# EAGLE schematic Display_RevA (EAGLE 6.3)
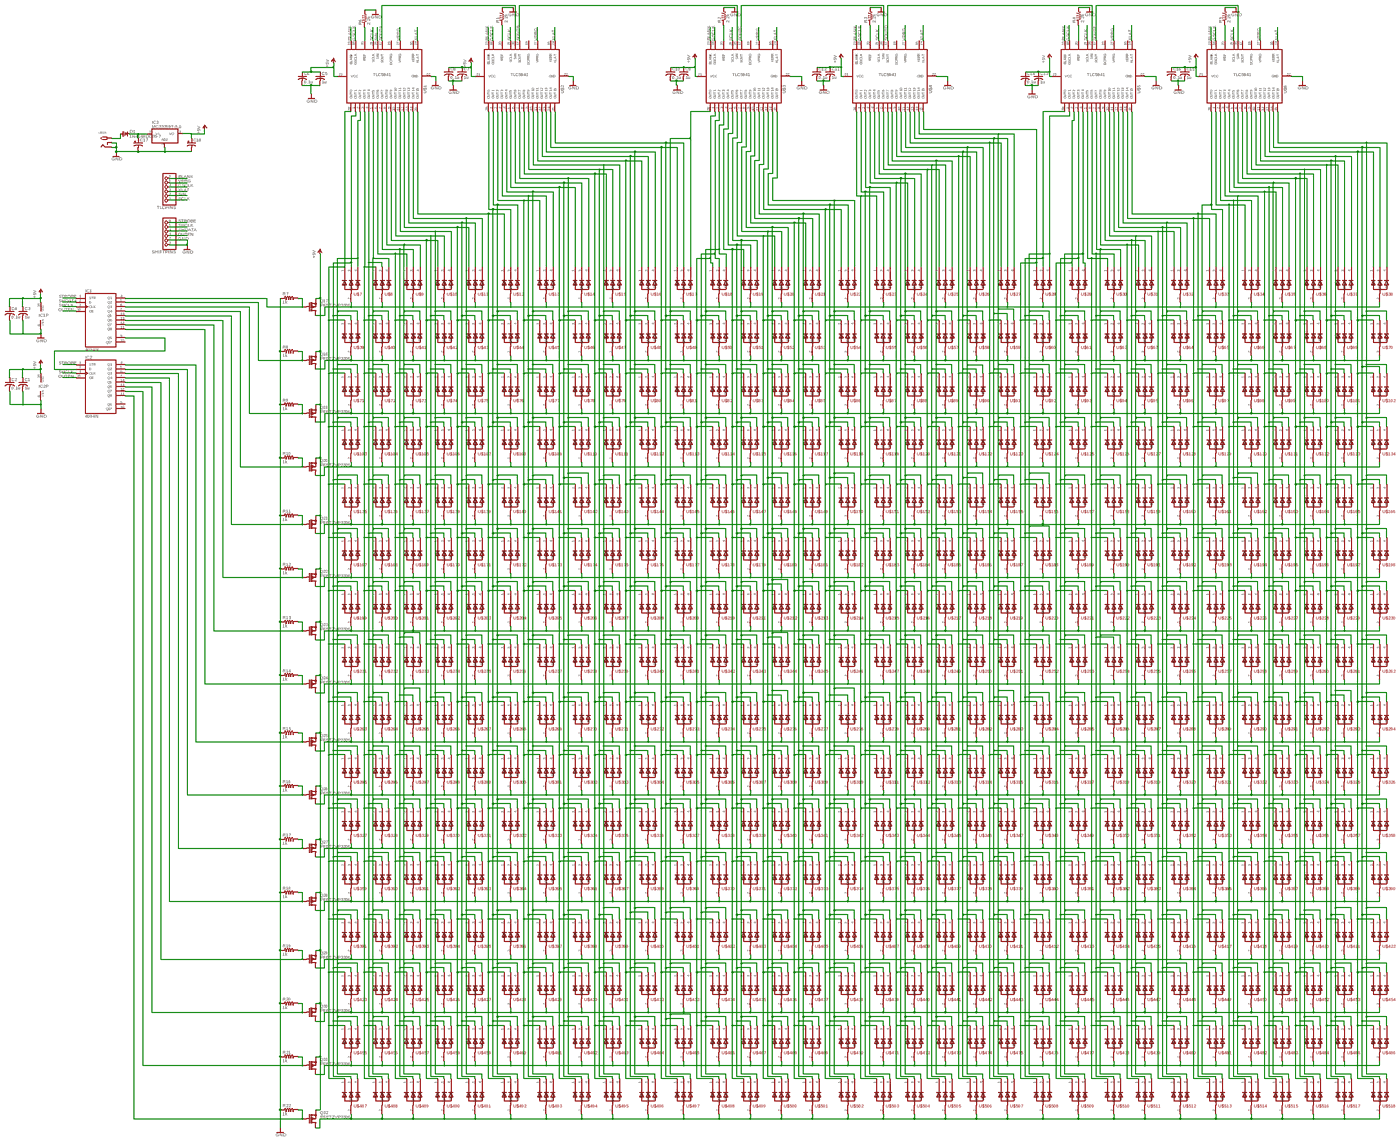
[diagram p0: schematic, sheet 1, overview]
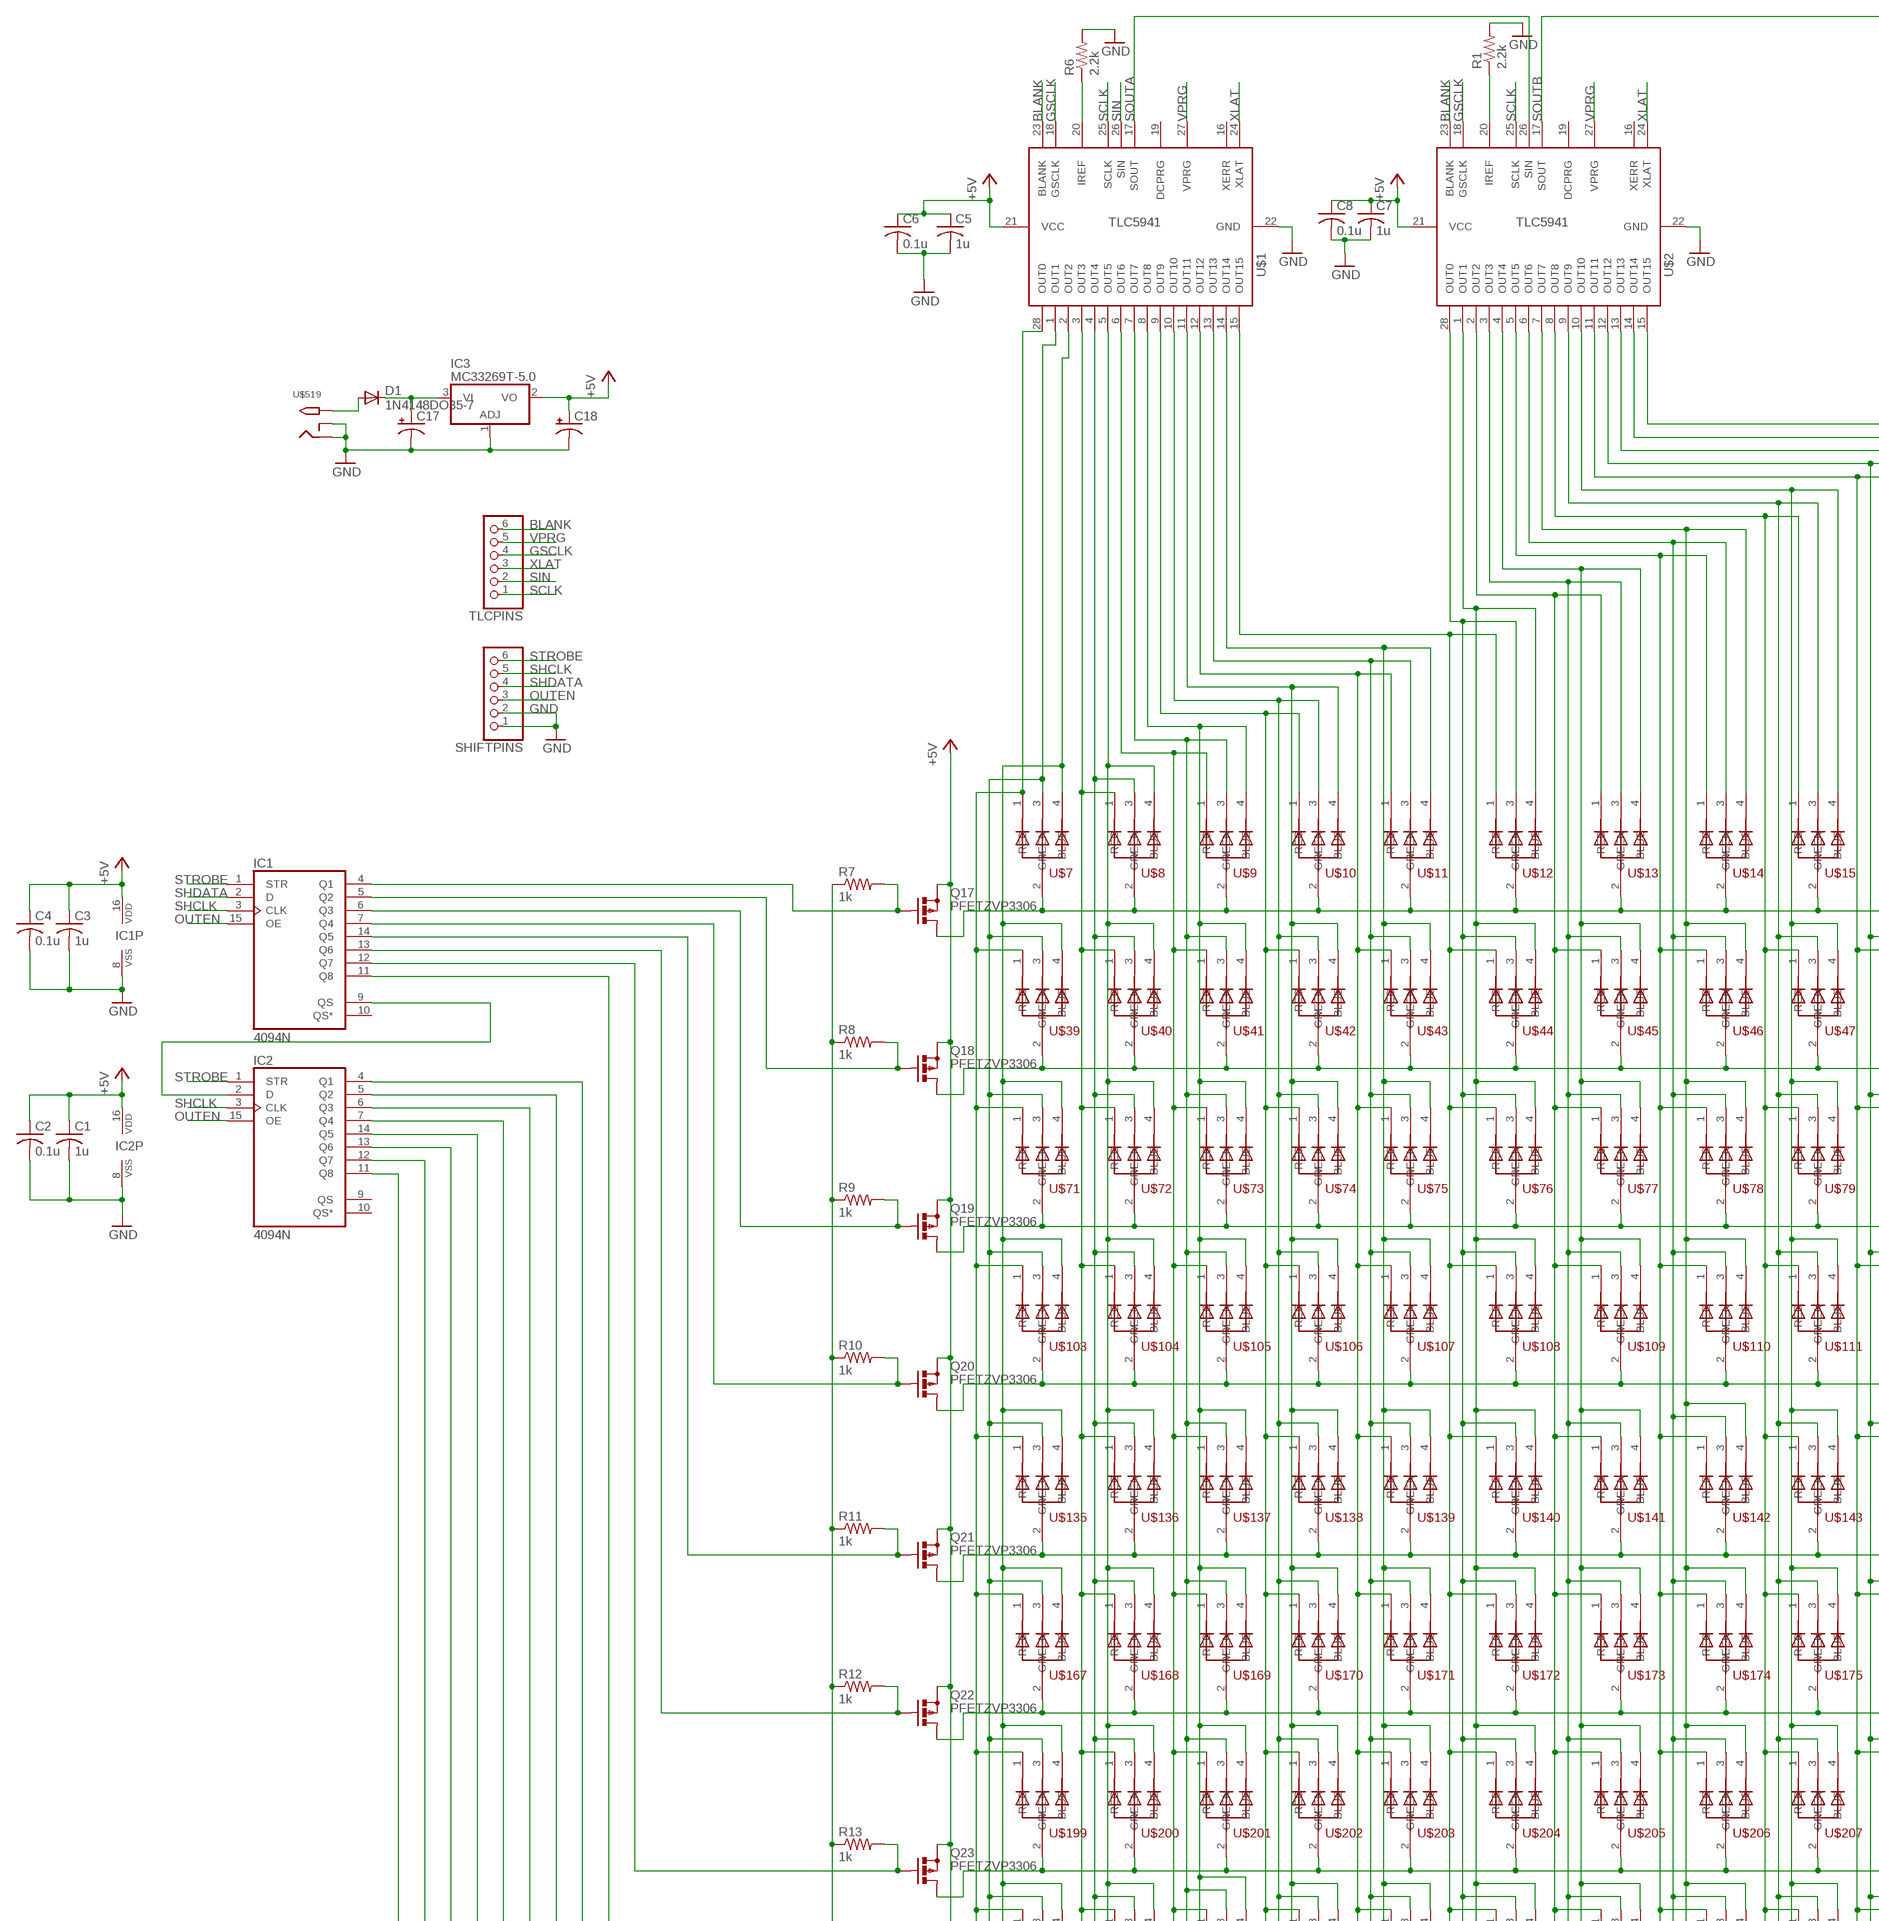
[diagram p1: schematic, sheet 1, part 1 of 4]
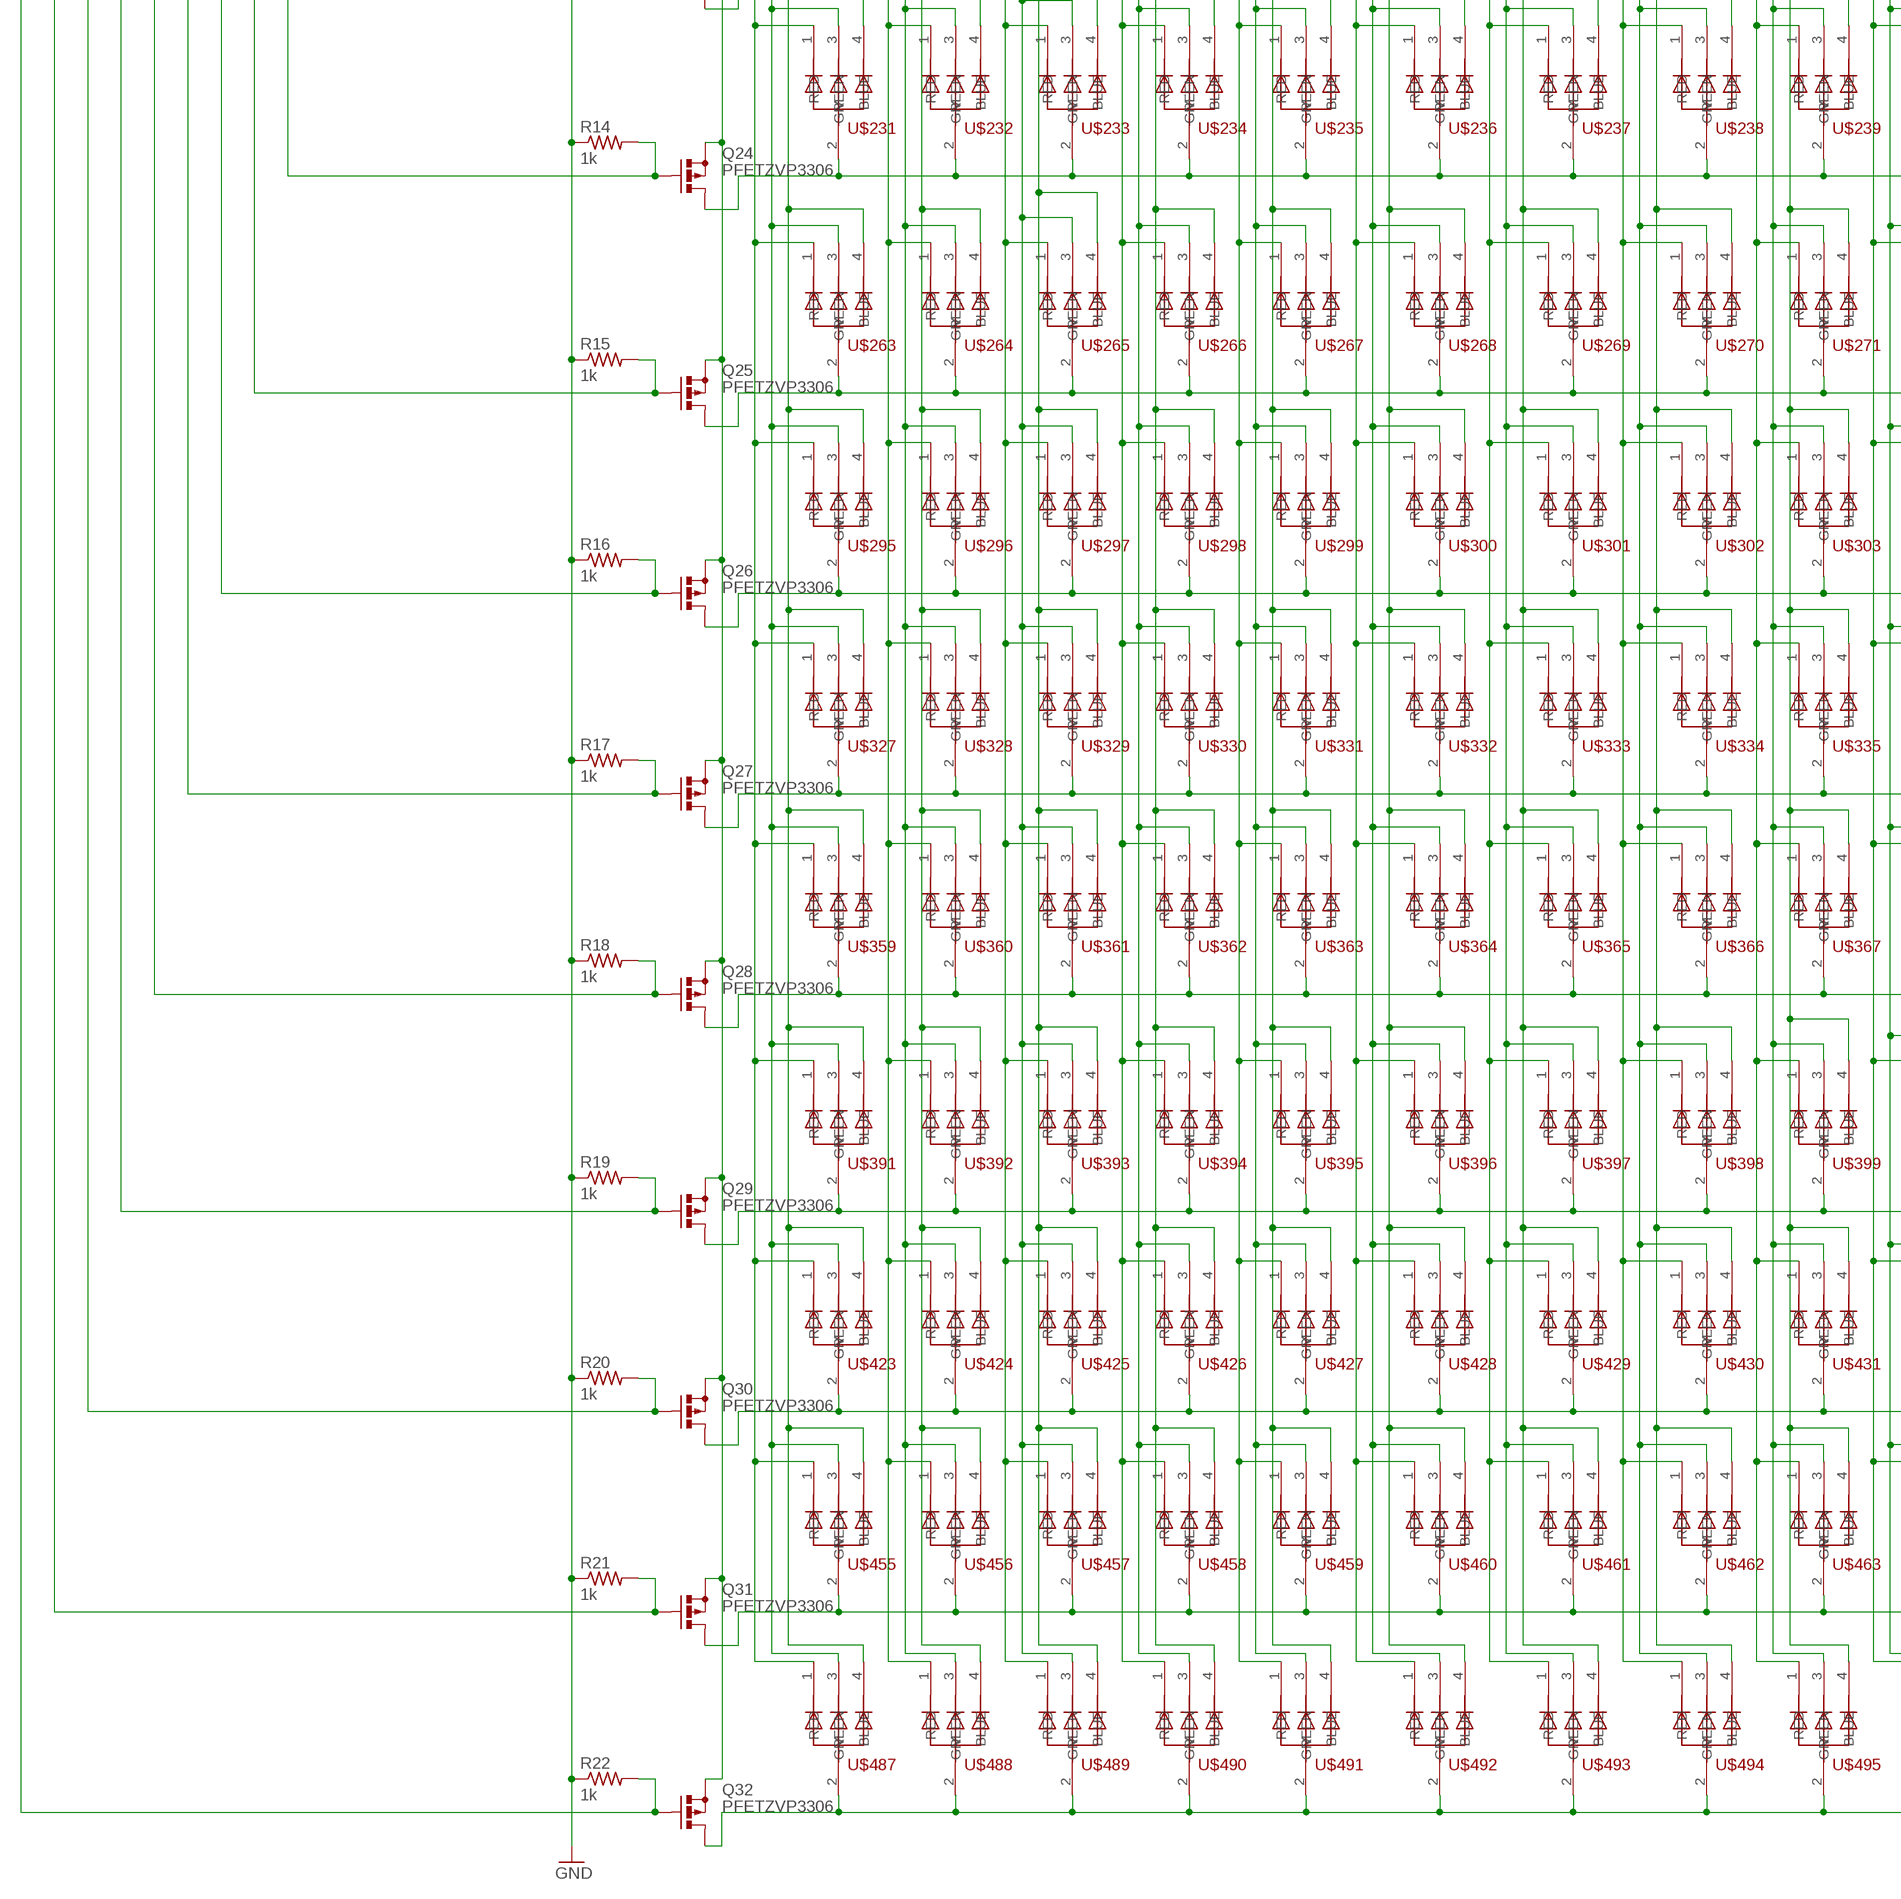
[diagram p2: schematic, sheet 1, part 2 of 4]
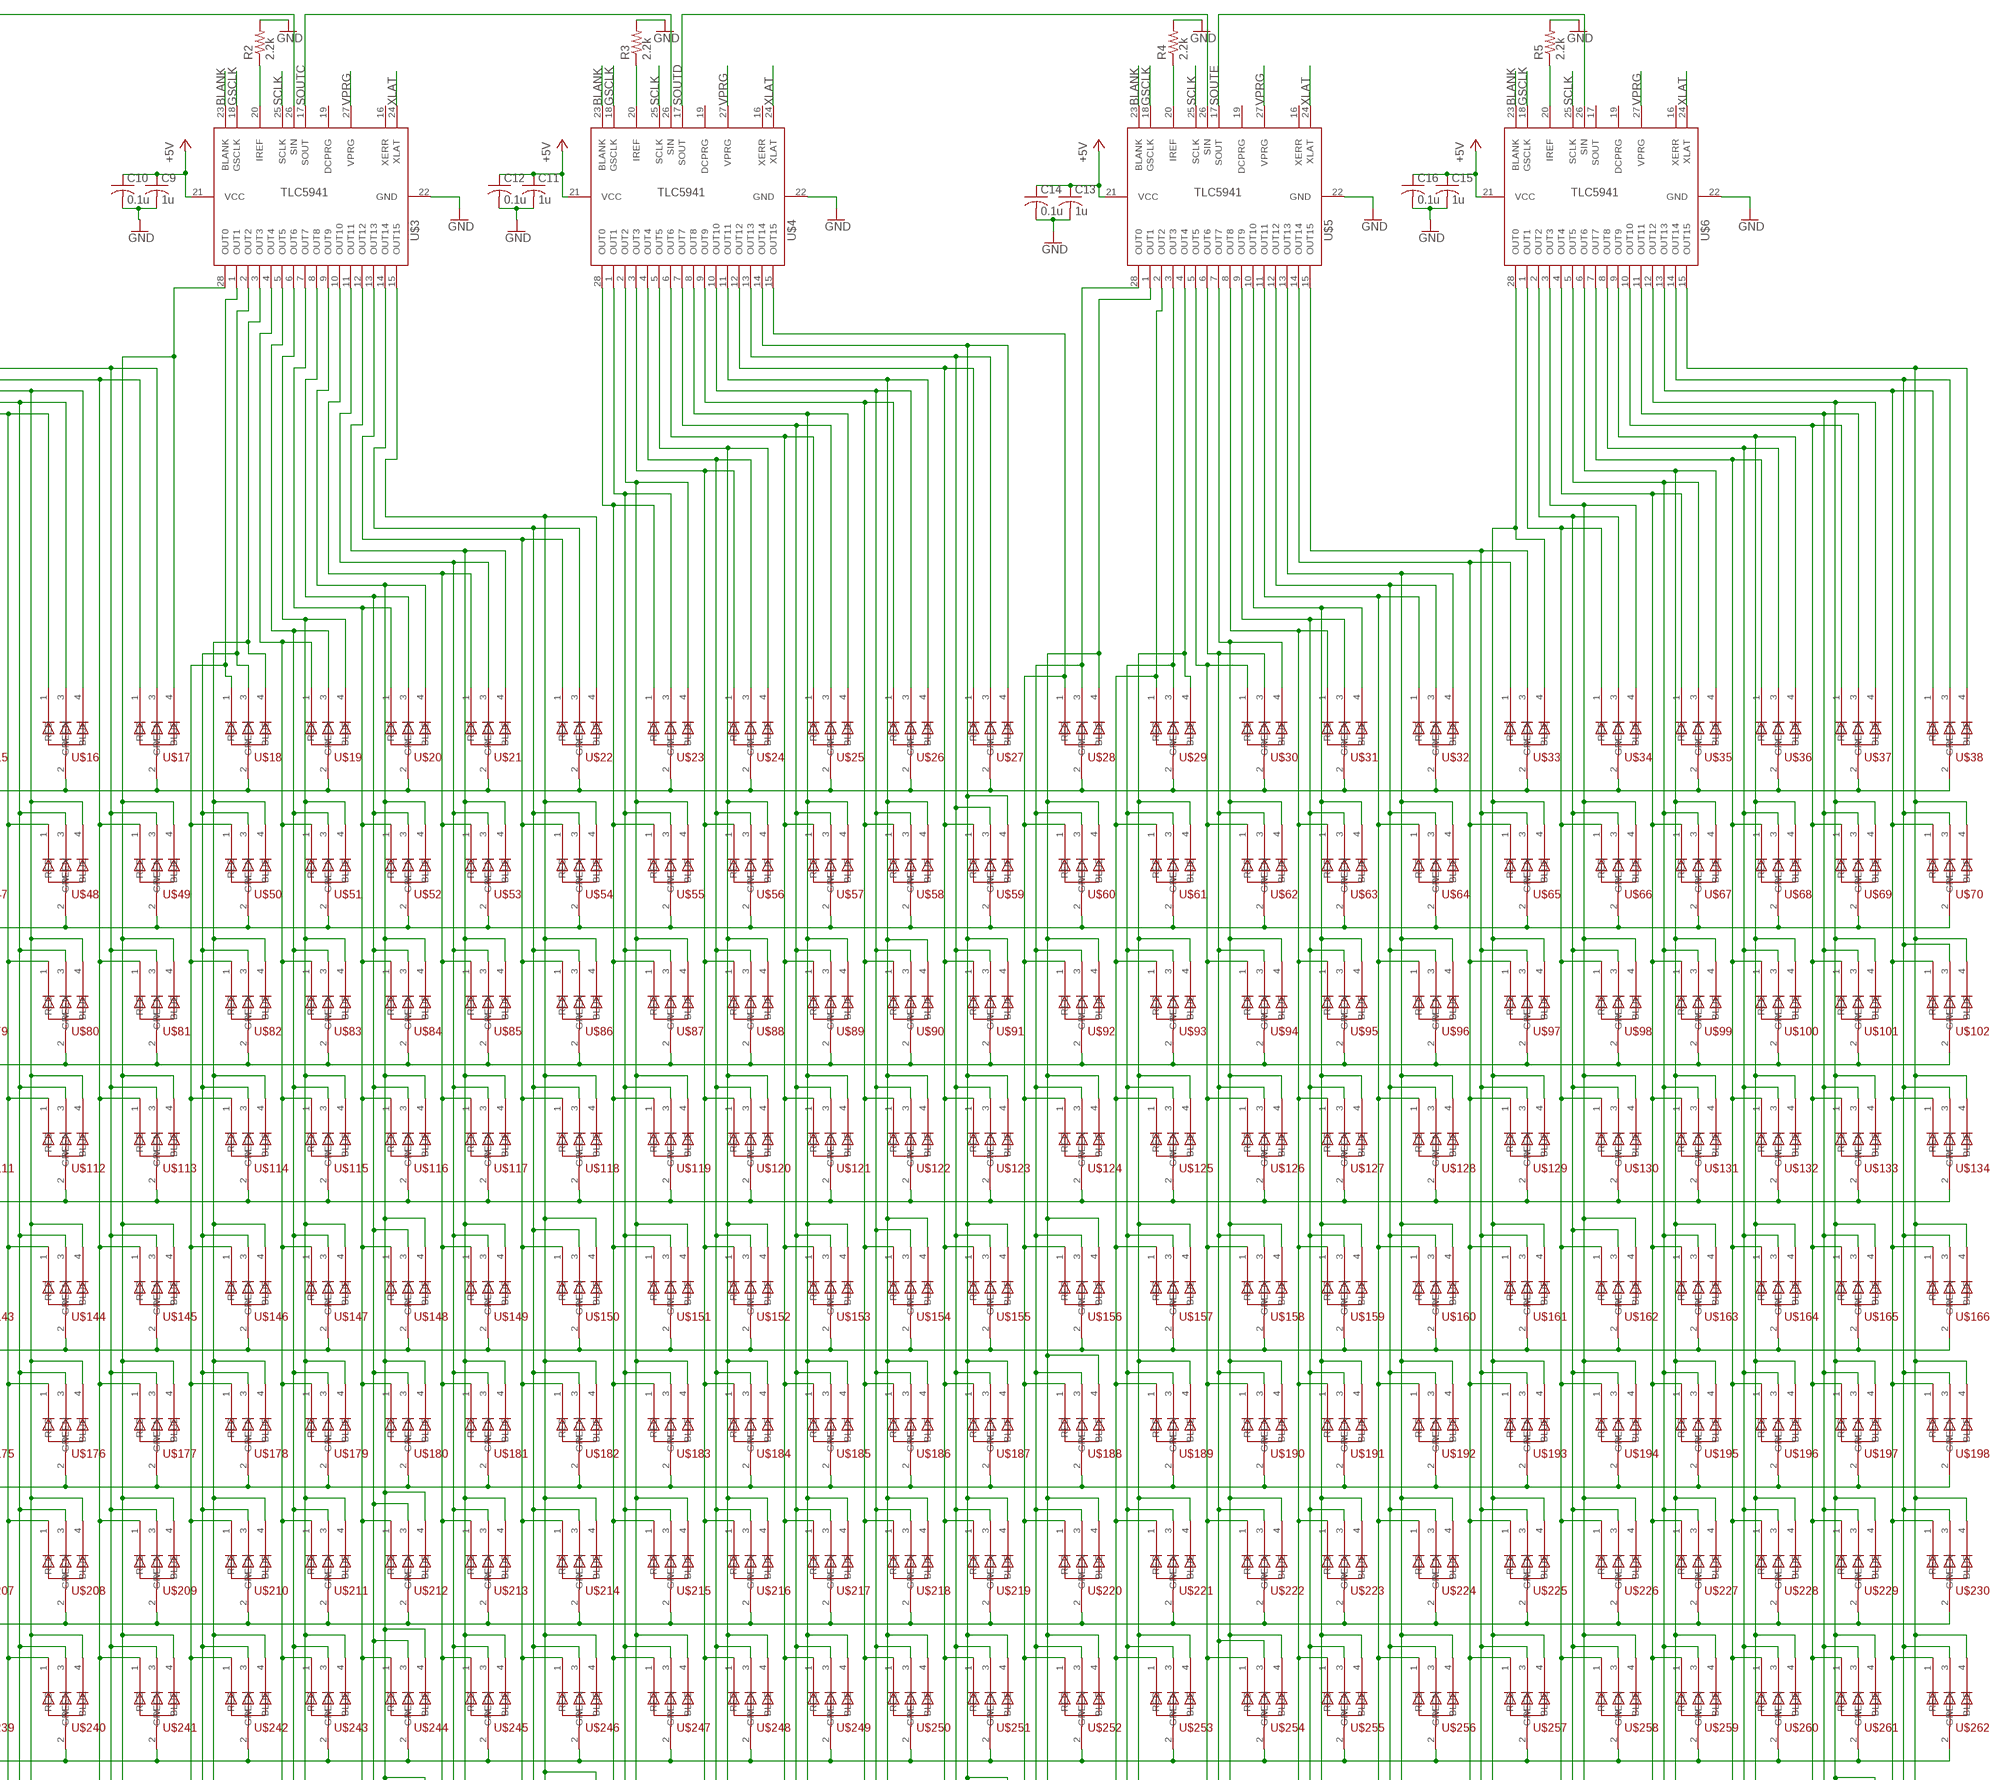
[diagram p3: schematic, sheet 1, part 3 of 4]
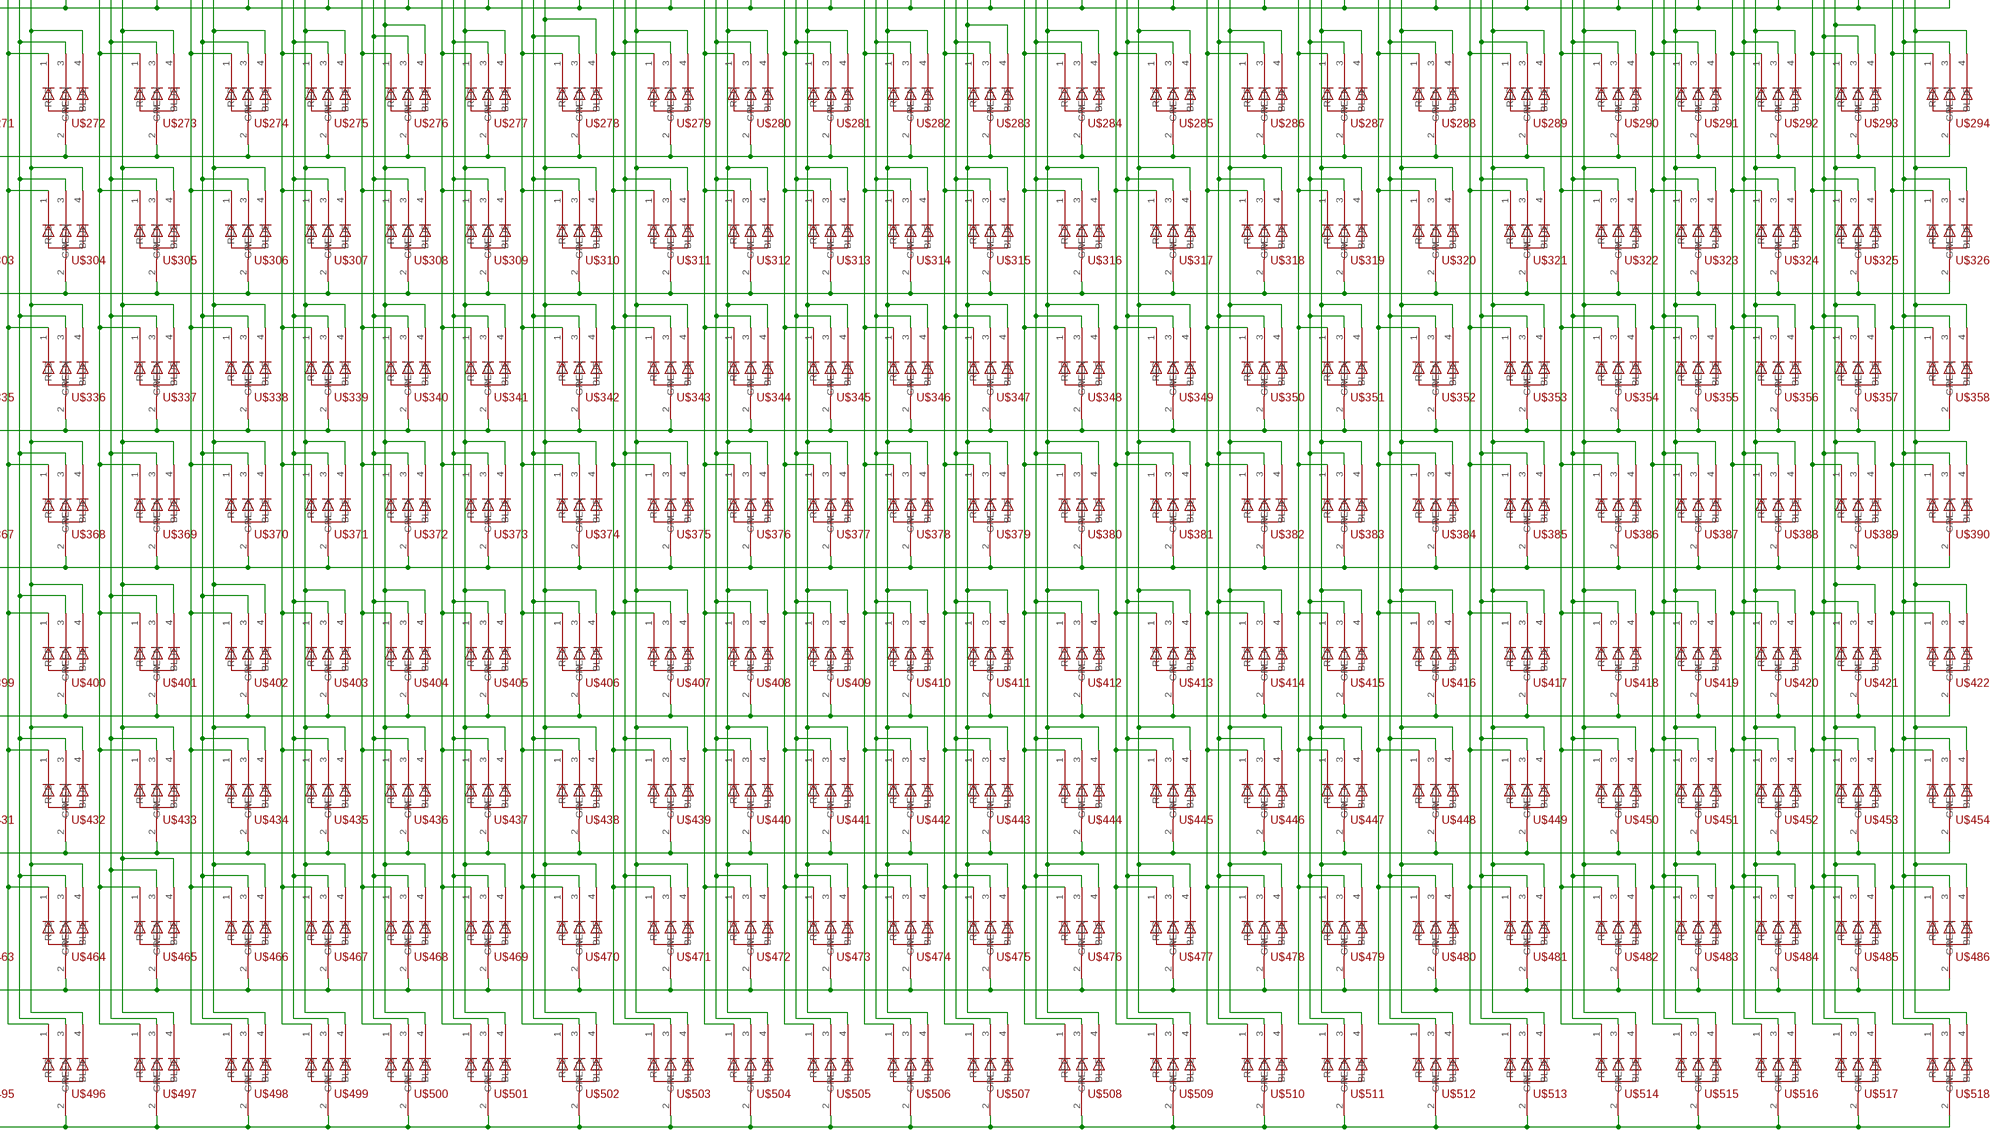
[diagram p4: schematic, sheet 1, part 4 of 4]

## Parts
C1  1u  C-USC0805  [C0805]
C2  0.1u  C-USC0805  [C0805]
C3  1u  C-USC0805  [C0805]
C4  0.1u  C-USC0805  [C0805]
C5  1u  C-USC0805  [C0805]
C6  0.1u  C-USC0805  [C0805]
C7  1u  C-USC0805  [C0805]
C8  0.1u  C-USC0805  [C0805]
C9  1u  C-USC0805  [C0805]
C10  0.1u  C-USC0805  [C0805]
C11  1u  C-USC0805  [C0805]
C12  0.1u  C-USC0805  [C0805]
C13  1u  C-USC0805  [C0805]
C14  0.1u  C-USC0805  [C0805]
C15  1u  C-USC0805  [C0805]
C16  0.1u  C-USC0805  [C0805]
C17  CPOL-USE2.5-5  [E2,5-5]
C18  CPOL-USE2.5-5  [E2,5-5]
D1  1N4148DO35-7  [DO35-7]
IC1  4094N  [DIL16]
IC2  4094N  [DIL16]
IC3  MC33269T-5.0  [TO220V]
Q17  PFETZVP3306  [TO92-OVAL]
Q18  PFETZVP3306  [TO92-OVAL]
Q19  PFETZVP3306  [TO92-OVAL]
Q20  PFETZVP3306  [TO92-OVAL]
Q21  PFETZVP3306  [TO92-OVAL]
Q22  PFETZVP3306  [TO92-OVAL]
Q23  PFETZVP3306  [TO92-OVAL]
Q24  PFETZVP3306  [TO92-OVAL]
Q25  PFETZVP3306  [TO92-OVAL]
Q26  PFETZVP3306  [TO92-OVAL]
Q27  PFETZVP3306  [TO92-OVAL]
Q28  PFETZVP3306  [TO92-OVAL]
Q29  PFETZVP3306  [TO92-OVAL]
Q30  PFETZVP3306  [TO92-OVAL]
Q31  PFETZVP3306  [TO92-OVAL]
Q32  PFETZVP3306  [TO92-OVAL]
R1  2.2k  R-US_R0805  [R0805]
R2  2.2k  R-US_R0805  [R0805]
R3  2.2k  R-US_R0805  [R0805]
R4  2.2k  R-US_R0805  [R0805]
R5  2.2k  R-US_R0805  [R0805]
R6  2.2k  R-US_R0805  [R0805]
R7  1k  R-US_R0805  [R0805]
R8  1k  R-US_R0805  [R0805]
R9  1k  R-US_R0805  [R0805]
R10  1k  R-US_R0805  [R0805]
R11  1k  R-US_R0805  [R0805]
R12  1k  R-US_R0805  [R0805]
R13  1k  R-US_R0805  [R0805]
R14  1k  R-US_R0805  [R0805]
R15  1k  R-US_R0805  [R0805]
R16  1k  R-US_R0805  [R0805]
R17  1k  R-US_R0805  [R0805]
R18  1k  R-US_R0805  [R0805]
R19  1k  R-US_R0805  [R0805]
R20  1k  R-US_R0805  [R0805]
R21  1k  R-US_R0805  [R0805]
R22  1k  R-US_R0805  [R0805]
SHIFTPINS  PINHD-1X6  [1X06]
TLCPINS  PINHD-1X6  [1X06]
U$1  TLC5940  [DIL28-3]
U$2  TLC5940  [DIL28-3]
U$3  TLC5940  [DIL28-3]
U$4  TLC5940  [DIL28-3]
U$5  TLC5940  [DIL28-3]
U$6  TLC5940  [DIL28-3]
U$7  RGBLEDAN  [LED5MMRGB]
U$8  RGBLEDAN  [LED5MMRGB]
U$9  RGBLEDAN  [LED5MMRGB]
U$10  RGBLEDAN  [LED5MMRGB]
U$11  RGBLEDAN  [LED5MMRGB]
U$12  RGBLEDAN  [LED5MMRGB]
U$13  RGBLEDAN  [LED5MMRGB]
U$14  RGBLEDAN  [LED5MMRGB]
U$15  RGBLEDAN  [LED5MMRGB]
U$16  RGBLEDAN  [LED5MMRGB]
U$17  RGBLEDAN  [LED5MMRGB]
U$18  RGBLEDAN  [LED5MMRGB]
U$19  RGBLEDAN  [LED5MMRGB]
U$20  RGBLEDAN  [LED5MMRGB]
U$21  RGBLEDAN  [LED5MMRGB]
U$22  RGBLEDAN  [LED5MMRGB]
U$23  RGBLEDAN  [LED5MMRGB]
U$24  RGBLEDAN  [LED5MMRGB]
U$25  RGBLEDAN  [LED5MMRGB]
U$26  RGBLEDAN  [LED5MMRGB]
U$27  RGBLEDAN  [LED5MMRGB]
U$28  RGBLEDAN  [LED5MMRGB]
U$29  RGBLEDAN  [LED5MMRGB]
U$30  RGBLEDAN  [LED5MMRGB]
U$31  RGBLEDAN  [LED5MMRGB]
U$32  RGBLEDAN  [LED5MMRGB]
U$33  RGBLEDAN  [LED5MMRGB]
U$34  RGBLEDAN  [LED5MMRGB]
U$35  RGBLEDAN  [LED5MMRGB]
U$36  RGBLEDAN  [LED5MMRGB]
U$37  RGBLEDAN  [LED5MMRGB]
U$38  RGBLEDAN  [LED5MMRGB]
U$39  RGBLEDAN  [LED5MMRGB]
U$40  RGBLEDAN  [LED5MMRGB]
U$41  RGBLEDAN  [LED5MMRGB]
U$42  RGBLEDAN  [LED5MMRGB]
U$43  RGBLEDAN  [LED5MMRGB]
U$44  RGBLEDAN  [LED5MMRGB]
U$45  RGBLEDAN  [LED5MMRGB]
U$46  RGBLEDAN  [LED5MMRGB]
U$47  RGBLEDAN  [LED5MMRGB]
U$48  RGBLEDAN  [LED5MMRGB]
U$49  RGBLEDAN  [LED5MMRGB]
U$50  RGBLEDAN  [LED5MMRGB]
U$51  RGBLEDAN  [LED5MMRGB]
U$52  RGBLEDAN  [LED5MMRGB]
U$53  RGBLEDAN  [LED5MMRGB]
U$54  RGBLEDAN  [LED5MMRGB]
U$55  RGBLEDAN  [LED5MMRGB]
U$56  RGBLEDAN  [LED5MMRGB]
U$57  RGBLEDAN  [LED5MMRGB]
U$58  RGBLEDAN  [LED5MMRGB]
U$59  RGBLEDAN  [LED5MMRGB]
U$60  RGBLEDAN  [LED5MMRGB]
U$61  RGBLEDAN  [LED5MMRGB]
U$62  RGBLEDAN  [LED5MMRGB]
U$63  RGBLEDAN  [LED5MMRGB]
U$64  RGBLEDAN  [LED5MMRGB]
U$65  RGBLEDAN  [LED5MMRGB]
U$66  RGBLEDAN  [LED5MMRGB]
U$67  RGBLEDAN  [LED5MMRGB]
U$68  RGBLEDAN  [LED5MMRGB]
U$69  RGBLEDAN  [LED5MMRGB]
U$70  RGBLEDAN  [LED5MMRGB]
U$71  RGBLEDAN  [LED5MMRGB]
U$72  RGBLEDAN  [LED5MMRGB]
U$73  RGBLEDAN  [LED5MMRGB]
U$74  RGBLEDAN  [LED5MMRGB]
U$75  RGBLEDAN  [LED5MMRGB]
U$76  RGBLEDAN  [LED5MMRGB]
U$77  RGBLEDAN  [LED5MMRGB]
U$78  RGBLEDAN  [LED5MMRGB]
U$79  RGBLEDAN  [LED5MMRGB]
U$80  RGBLEDAN  [LED5MMRGB]
U$81  RGBLEDAN  [LED5MMRGB]
U$82  RGBLEDAN  [LED5MMRGB]
U$83  RGBLEDAN  [LED5MMRGB]
U$84  RGBLEDAN  [LED5MMRGB]
U$85  RGBLEDAN  [LED5MMRGB]
U$86  RGBLEDAN  [LED5MMRGB]
U$87  RGBLEDAN  [LED5MMRGB]
U$88  RGBLEDAN  [LED5MMRGB]
U$89  RGBLEDAN  [LED5MMRGB]
U$90  RGBLEDAN  [LED5MMRGB]
U$91  RGBLEDAN  [LED5MMRGB]
U$92  RGBLEDAN  [LED5MMRGB]
U$93  RGBLEDAN  [LED5MMRGB]
U$94  RGBLEDAN  [LED5MMRGB]
U$95  RGBLEDAN  [LED5MMRGB]
U$96  RGBLEDAN  [LED5MMRGB]
U$97  RGBLEDAN  [LED5MMRGB]
U$98  RGBLEDAN  [LED5MMRGB]
U$99  RGBLEDAN  [LED5MMRGB]
U$100  RGBLEDAN  [LED5MMRGB]
U$101  RGBLEDAN  [LED5MMRGB]
U$102  RGBLEDAN  [LED5MMRGB]
U$103  RGBLEDAN  [LED5MMRGB]
U$104  RGBLEDAN  [LED5MMRGB]
U$105  RGBLEDAN  [LED5MMRGB]
U$106  RGBLEDAN  [LED5MMRGB]
U$107  RGBLEDAN  [LED5MMRGB]
U$108  RGBLEDAN  [LED5MMRGB]
U$109  RGBLEDAN  [LED5MMRGB]
U$110  RGBLEDAN  [LED5MMRGB]
U$111  RGBLEDAN  [LED5MMRGB]
U$112  RGBLEDAN  [LED5MMRGB]
U$113  RGBLEDAN  [LED5MMRGB]
U$114  RGBLEDAN  [LED5MMRGB]
U$115  RGBLEDAN  [LED5MMRGB]
U$116  RGBLEDAN  [LED5MMRGB]
U$117  RGBLEDAN  [LED5MMRGB]
U$118  RGBLEDAN  [LED5MMRGB]
U$119  RGBLEDAN  [LED5MMRGB]
U$120  RGBLEDAN  [LED5MMRGB]
U$121  RGBLEDAN  [LED5MMRGB]
U$122  RGBLEDAN  [LED5MMRGB]
U$123  RGBLEDAN  [LED5MMRGB]
U$124  RGBLEDAN  [LED5MMRGB]
U$125  RGBLEDAN  [LED5MMRGB]
U$126  RGBLEDAN  [LED5MMRGB]
U$127  RGBLEDAN  [LED5MMRGB]
U$128  RGBLEDAN  [LED5MMRGB]
U$129  RGBLEDAN  [LED5MMRGB]
U$130  RGBLEDAN  [LED5MMRGB]
U$131  RGBLEDAN  [LED5MMRGB]
U$132  RGBLEDAN  [LED5MMRGB]
U$133  RGBLEDAN  [LED5MMRGB]
U$134  RGBLEDAN  [LED5MMRGB]
U$135  RGBLEDAN  [LED5MMRGB]
U$136  RGBLEDAN  [LED5MMRGB]
U$137  RGBLEDAN  [LED5MMRGB]
U$138  RGBLEDAN  [LED5MMRGB]
U$139  RGBLEDAN  [LED5MMRGB]
U$140  RGBLEDAN  [LED5MMRGB]
U$141  RGBLEDAN  [LED5MMRGB]
U$142  RGBLEDAN  [LED5MMRGB]
U$143  RGBLEDAN  [LED5MMRGB]
U$144  RGBLEDAN  [LED5MMRGB]
U$145  RGBLEDAN  [LED5MMRGB]
U$146  RGBLEDAN  [LED5MMRGB]
U$147  RGBLEDAN  [LED5MMRGB]
U$148  RGBLEDAN  [LED5MMRGB]
U$149  RGBLEDAN  [LED5MMRGB]
U$150  RGBLEDAN  [LED5MMRGB]
U$151  RGBLEDAN  [LED5MMRGB]
U$152  RGBLEDAN  [LED5MMRGB]
U$153  RGBLEDAN  [LED5MMRGB]
U$154  RGBLEDAN  [LED5MMRGB]
U$155  RGBLEDAN  [LED5MMRGB]
U$156  RGBLEDAN  [LED5MMRGB]
U$157  RGBLEDAN  [LED5MMRGB]
U$158  RGBLEDAN  [LED5MMRGB]
U$159  RGBLEDAN  [LED5MMRGB]
U$160  RGBLEDAN  [LED5MMRGB]
U$161  RGBLEDAN  [LED5MMRGB]
U$162  RGBLEDAN  [LED5MMRGB]
U$163  RGBLEDAN  [LED5MMRGB]
U$164  RGBLEDAN  [LED5MMRGB]
U$165  RGBLEDAN  [LED5MMRGB]
U$166  RGBLEDAN  [LED5MMRGB]
U$167  RGBLEDAN  [LED5MMRGB]
U$168  RGBLEDAN  [LED5MMRGB]
U$169  RGBLEDAN  [LED5MMRGB]
U$170  RGBLEDAN  [LED5MMRGB]
U$171  RGBLEDAN  [LED5MMRGB]
U$172  RGBLEDAN  [LED5MMRGB]
U$173  RGBLEDAN  [LED5MMRGB]
U$174  RGBLEDAN  [LED5MMRGB]
U$175  RGBLEDAN  [LED5MMRGB]
U$176  RGBLEDAN  [LED5MMRGB]
U$177  RGBLEDAN  [LED5MMRGB]
U$178  RGBLEDAN  [LED5MMRGB]
U$179  RGBLEDAN  [LED5MMRGB]
U$180  RGBLEDAN  [LED5MMRGB]
U$181  RGBLEDAN  [LED5MMRGB]
U$182  RGBLEDAN  [LED5MMRGB]
U$183  RGBLEDAN  [LED5MMRGB]
U$184  RGBLEDAN  [LED5MMRGB]
U$185  RGBLEDAN  [LED5MMRGB]
U$186  RGBLEDAN  [LED5MMRGB]
U$187  RGBLEDAN  [LED5MMRGB]
U$188  RGBLEDAN  [LED5MMRGB]
U$189  RGBLEDAN  [LED5MMRGB]
U$190  RGBLEDAN  [LED5MMRGB]
U$191  RGBLEDAN  [LED5MMRGB]
U$192  RGBLEDAN  [LED5MMRGB]
U$193  RGBLEDAN  [LED5MMRGB]
U$194  RGBLEDAN  [LED5MMRGB]
U$195  RGBLEDAN  [LED5MMRGB]
U$196  RGBLEDAN  [LED5MMRGB]
U$197  RGBLEDAN  [LED5MMRGB]
U$198  RGBLEDAN  [LED5MMRGB]
U$199  RGBLEDAN  [LED5MMRGB]
U$200  RGBLEDAN  [LED5MMRGB]
U$201  RGBLEDAN  [LED5MMRGB]
U$202  RGBLEDAN  [LED5MMRGB]
U$203  RGBLEDAN  [LED5MMRGB]
U$204  RGBLEDAN  [LED5MMRGB]
U$205  RGBLEDAN  [LED5MMRGB]
U$206  RGBLEDAN  [LED5MMRGB]
U$207  RGBLEDAN  [LED5MMRGB]
U$208  RGBLEDAN  [LED5MMRGB]
U$209  RGBLEDAN  [LED5MMRGB]
U$210  RGBLEDAN  [LED5MMRGB]
U$211  RGBLEDAN  [LED5MMRGB]
U$212  RGBLEDAN  [LED5MMRGB]
U$213  RGBLEDAN  [LED5MMRGB]
U$214  RGBLEDAN  [LED5MMRGB]
U$215  RGBLEDAN  [LED5MMRGB]
U$216  RGBLEDAN  [LED5MMRGB]
U$217  RGBLEDAN  [LED5MMRGB]
U$218  RGBLEDAN  [LED5MMRGB]
U$219  RGBLEDAN  [LED5MMRGB]
U$220  RGBLEDAN  [LED5MMRGB]
U$221  RGBLEDAN  [LED5MMRGB]
U$222  RGBLEDAN  [LED5MMRGB]
U$223  RGBLEDAN  [LED5MMRGB]
U$224  RGBLEDAN  [LED5MMRGB]
U$225  RGBLEDAN  [LED5MMRGB]
U$226  RGBLEDAN  [LED5MMRGB]
U$227  RGBLEDAN  [LED5MMRGB]
U$228  RGBLEDAN  [LED5MMRGB]
U$229  RGBLEDAN  [LED5MMRGB]
U$230  RGBLEDAN  [LED5MMRGB]
U$231  RGBLEDAN  [LED5MMRGB]
U$232  RGBLEDAN  [LED5MMRGB]
U$233  RGBLEDAN  [LED5MMRGB]
U$234  RGBLEDAN  [LED5MMRGB]
U$235  RGBLEDAN  [LED5MMRGB]
U$236  RGBLEDAN  [LED5MMRGB]
U$237  RGBLEDAN  [LED5MMRGB]
U$238  RGBLEDAN  [LED5MMRGB]
U$239  RGBLEDAN  [LED5MMRGB]
U$240  RGBLEDAN  [LED5MMRGB]
U$241  RGBLEDAN  [LED5MMRGB]
U$242  RGBLEDAN  [LED5MMRGB]
U$243  RGBLEDAN  [LED5MMRGB]
U$244  RGBLEDAN  [LED5MMRGB]
U$245  RGBLEDAN  [LED5MMRGB]
U$246  RGBLEDAN  [LED5MMRGB]
U$247  RGBLEDAN  [LED5MMRGB]
U$248  RGBLEDAN  [LED5MMRGB]
U$249  RGBLEDAN  [LED5MMRGB]
U$250  RGBLEDAN  [LED5MMRGB]
U$251  RGBLEDAN  [LED5MMRGB]
U$252  RGBLEDAN  [LED5MMRGB]
U$253  RGBLEDAN  [LED5MMRGB]
U$254  RGBLEDAN  [LED5MMRGB]
U$255  RGBLEDAN  [LED5MMRGB]
U$256  RGBLEDAN  [LED5MMRGB]
U$257  RGBLEDAN  [LED5MMRGB]
U$258  RGBLEDAN  [LED5MMRGB]
U$259  RGBLEDAN  [LED5MMRGB]
U$260  RGBLEDAN  [LED5MMRGB]
U$261  RGBLEDAN  [LED5MMRGB]
U$262  RGBLEDAN  [LED5MMRGB]
U$263  RGBLEDAN  [LED5MMRGB]
U$264  RGBLEDAN  [LED5MMRGB]
U$265  RGBLEDAN  [LED5MMRGB]
U$266  RGBLEDAN  [LED5MMRGB]
U$267  RGBLEDAN  [LED5MMRGB]
U$268  RGBLEDAN  [LED5MMRGB]
U$269  RGBLEDAN  [LED5MMRGB]
U$270  RGBLEDAN  [LED5MMRGB]
U$271  RGBLEDAN  [LED5MMRGB]
U$272  RGBLEDAN  [LED5MMRGB]
U$273  RGBLEDAN  [LED5MMRGB]
U$274  RGBLEDAN  [LED5MMRGB]
U$275  RGBLEDAN  [LED5MMRGB]
U$276  RGBLEDAN  [LED5MMRGB]
U$277  RGBLEDAN  [LED5MMRGB]
U$278  RGBLEDAN  [LED5MMRGB]
U$279  RGBLEDAN  [LED5MMRGB]
U$280  RGBLEDAN  [LED5MMRGB]
U$281  RGBLEDAN  [LED5MMRGB]
U$282  RGBLEDAN  [LED5MMRGB]
U$283  RGBLEDAN  [LED5MMRGB]
U$284  RGBLEDAN  [LED5MMRGB]
U$285  RGBLEDAN  [LED5MMRGB]
U$286  RGBLEDAN  [LED5MMRGB]
U$287  RGBLEDAN  [LED5MMRGB]
U$288  RGBLEDAN  [LED5MMRGB]
U$289  RGBLEDAN  [LED5MMRGB]
U$290  RGBLEDAN  [LED5MMRGB]
U$291  RGBLEDAN  [LED5MMRGB]
U$292  RGBLEDAN  [LED5MMRGB]
U$293  RGBLEDAN  [LED5MMRGB]
U$294  RGBLEDAN  [LED5MMRGB]
U$295  RGBLEDAN  [LED5MMRGB]
U$296  RGBLEDAN  [LED5MMRGB]
U$297  RGBLEDAN  [LED5MMRGB]
U$298  RGBLEDAN  [LED5MMRGB]
U$299  RGBLEDAN  [LED5MMRGB]
U$300  RGBLEDAN  [LED5MMRGB]
U$301  RGBLEDAN  [LED5MMRGB]
U$302  RGBLEDAN  [LED5MMRGB]
U$303  RGBLEDAN  [LED5MMRGB]
U$304  RGBLEDAN  [LED5MMRGB]
U$305  RGBLEDAN  [LED5MMRGB]
U$306  RGBLEDAN  [LED5MMRGB]
U$307  RGBLEDAN  [LED5MMRGB]
U$308  RGBLEDAN  [LED5MMRGB]
U$309  RGBLEDAN  [LED5MMRGB]
U$310  RGBLEDAN  [LED5MMRGB]
U$311  RGBLEDAN  [LED5MMRGB]
U$312  RGBLEDAN  [LED5MMRGB]
U$313  RGBLEDAN  [LED5MMRGB]
U$314  RGBLEDAN  [LED5MMRGB]
U$315  RGBLEDAN  [LED5MMRGB]
U$316  RGBLEDAN  [LED5MMRGB]
U$317  RGBLEDAN  [LED5MMRGB]
U$318  RGBLEDAN  [LED5MMRGB]
U$319  RGBLEDAN  [LED5MMRGB]
U$320  RGBLEDAN  [LED5MMRGB]
U$321  RGBLEDAN  [LED5MMRGB]
U$322  RGBLEDAN  [LED5MMRGB]
U$323  RGBLEDAN  [LED5MMRGB]
U$324  RGBLEDAN  [LED5MMRGB]
U$325  RGBLEDAN  [LED5MMRGB]
U$326  RGBLEDAN  [LED5MMRGB]
U$327  RGBLEDAN  [LED5MMRGB]
U$328  RGBLEDAN  [LED5MMRGB]
U$329  RGBLEDAN  [LED5MMRGB]
U$330  RGBLEDAN  [LED5MMRGB]
U$331  RGBLEDAN  [LED5MMRGB]
U$332  RGBLEDAN  [LED5MMRGB]
U$333  RGBLEDAN  [LED5MMRGB]
U$334  RGBLEDAN  [LED5MMRGB]
U$335  RGBLEDAN  [LED5MMRGB]
U$336  RGBLEDAN  [LED5MMRGB]
U$337  RGBLEDAN  [LED5MMRGB]
U$338  RGBLEDAN  [LED5MMRGB]
U$339  RGBLEDAN  [LED5MMRGB]
U$340  RGBLEDAN  [LED5MMRGB]
U$341  RGBLEDAN  [LED5MMRGB]
U$342  RGBLEDAN  [LED5MMRGB]
U$343  RGBLEDAN  [LED5MMRGB]
U$344  RGBLEDAN  [LED5MMRGB]
U$345  RGBLEDAN  [LED5MMRGB]
U$346  RGBLEDAN  [LED5MMRGB]
U$347  RGBLEDAN  [LED5MMRGB]
U$348  RGBLEDAN  [LED5MMRGB]
U$349  RGBLEDAN  [LED5MMRGB]
U$350  RGBLEDAN  [LED5MMRGB]
U$351  RGBLEDAN  [LED5MMRGB]
U$352  RGBLEDAN  [LED5MMRGB]
U$353  RGBLEDAN  [LED5MMRGB]
U$354  RGBLEDAN  [LED5MMRGB]
U$355  RGBLEDAN  [LED5MMRGB]
U$356  RGBLEDAN  [LED5MMRGB]
U$357  RGBLEDAN  [LED5MMRGB]
U$358  RGBLEDAN  [LED5MMRGB]
U$359  RGBLEDAN  [LED5MMRGB]
U$360  RGBLEDAN  [LED5MMRGB]
U$361  RGBLEDAN  [LED5MMRGB]
U$362  RGBLEDAN  [LED5MMRGB]
U$363  RGBLEDAN  [LED5MMRGB]
U$364  RGBLEDAN  [LED5MMRGB]
U$365  RGBLEDAN  [LED5MMRGB]
U$366  RGBLEDAN  [LED5MMRGB]
U$367  RGBLEDAN  [LED5MMRGB]
U$368  RGBLEDAN  [LED5MMRGB]
U$369  RGBLEDAN  [LED5MMRGB]
U$370  RGBLEDAN  [LED5MMRGB]
U$371  RGBLEDAN  [LED5MMRGB]
U$372  RGBLEDAN  [LED5MMRGB]
U$373  RGBLEDAN  [LED5MMRGB]
U$374  RGBLEDAN  [LED5MMRGB]
U$375  RGBLEDAN  [LED5MMRGB]
U$376  RGBLEDAN  [LED5MMRGB]
U$377  RGBLEDAN  [LED5MMRGB]
U$378  RGBLEDAN  [LED5MMRGB]
U$379  RGBLEDAN  [LED5MMRGB]
U$380  RGBLEDAN  [LED5MMRGB]
U$381  RGBLEDAN  [LED5MMRGB]
U$382  RGBLEDAN  [LED5MMRGB]
U$383  RGBLEDAN  [LED5MMRGB]
U$384  RGBLEDAN  [LED5MMRGB]
U$385  RGBLEDAN  [LED5MMRGB]
U$386  RGBLEDAN  [LED5MMRGB]
U$387  RGBLEDAN  [LED5MMRGB]
U$388  RGBLEDAN  [LED5MMRGB]
U$389  RGBLEDAN  [LED5MMRGB]
U$390  RGBLEDAN  [LED5MMRGB]
U$391  RGBLEDAN  [LED5MMRGB]
U$392  RGBLEDAN  [LED5MMRGB]
U$393  RGBLEDAN  [LED5MMRGB]
U$394  RGBLEDAN  [LED5MMRGB]
U$395  RGBLEDAN  [LED5MMRGB]
U$396  RGBLEDAN  [LED5MMRGB]
U$397  RGBLEDAN  [LED5MMRGB]
U$398  RGBLEDAN  [LED5MMRGB]
U$399  RGBLEDAN  [LED5MMRGB]
U$400  RGBLEDAN  [LED5MMRGB]
U$401  RGBLEDAN  [LED5MMRGB]
U$402  RGBLEDAN  [LED5MMRGB]
U$403  RGBLEDAN  [LED5MMRGB]
U$404  RGBLEDAN  [LED5MMRGB]
U$405  RGBLEDAN  [LED5MMRGB]
U$406  RGBLEDAN  [LED5MMRGB]
U$407  RGBLEDAN  [LED5MMRGB]
U$408  RGBLEDAN  [LED5MMRGB]
U$409  RGBLEDAN  [LED5MMRGB]
U$410  RGBLEDAN  [LED5MMRGB]
U$411  RGBLEDAN  [LED5MMRGB]
U$412  RGBLEDAN  [LED5MMRGB]
U$413  RGBLEDAN  [LED5MMRGB]
U$414  RGBLEDAN  [LED5MMRGB]
U$415  RGBLEDAN  [LED5MMRGB]
U$416  RGBLEDAN  [LED5MMRGB]
U$417  RGBLEDAN  [LED5MMRGB]
U$418  RGBLEDAN  [LED5MMRGB]
U$419  RGBLEDAN  [LED5MMRGB]
U$420  RGBLEDAN  [LED5MMRGB]
U$421  RGBLEDAN  [LED5MMRGB]
U$422  RGBLEDAN  [LED5MMRGB]
U$423  RGBLEDAN  [LED5MMRGB]
U$424  RGBLEDAN  [LED5MMRGB]
U$425  RGBLEDAN  [LED5MMRGB]
U$426  RGBLEDAN  [LED5MMRGB]
U$427  RGBLEDAN  [LED5MMRGB]
U$428  RGBLEDAN  [LED5MMRGB]
U$429  RGBLEDAN  [LED5MMRGB]
U$430  RGBLEDAN  [LED5MMRGB]
U$431  RGBLEDAN  [LED5MMRGB]
U$432  RGBLEDAN  [LED5MMRGB]
U$433  RGBLEDAN  [LED5MMRGB]
U$434  RGBLEDAN  [LED5MMRGB]
U$435  RGBLEDAN  [LED5MMRGB]
U$436  RGBLEDAN  [LED5MMRGB]
U$437  RGBLEDAN  [LED5MMRGB]
U$438  RGBLEDAN  [LED5MMRGB]
U$439  RGBLEDAN  [LED5MMRGB]
U$440  RGBLEDAN  [LED5MMRGB]
U$441  RGBLEDAN  [LED5MMRGB]
U$442  RGBLEDAN  [LED5MMRGB]
U$443  RGBLEDAN  [LED5MMRGB]
U$444  RGBLEDAN  [LED5MMRGB]
U$445  RGBLEDAN  [LED5MMRGB]
U$446  RGBLEDAN  [LED5MMRGB]
U$447  RGBLEDAN  [LED5MMRGB]
U$448  RGBLEDAN  [LED5MMRGB]
U$449  RGBLEDAN  [LED5MMRGB]
U$450  RGBLEDAN  [LED5MMRGB]
U$451  RGBLEDAN  [LED5MMRGB]
U$452  RGBLEDAN  [LED5MMRGB]
U$453  RGBLEDAN  [LED5MMRGB]
U$454  RGBLEDAN  [LED5MMRGB]
U$455  RGBLEDAN  [LED5MMRGB]
U$456  RGBLEDAN  [LED5MMRGB]
U$457  RGBLEDAN  [LED5MMRGB]
U$458  RGBLEDAN  [LED5MMRGB]
U$459  RGBLEDAN  [LED5MMRGB]
U$460  RGBLEDAN  [LED5MMRGB]
U$461  RGBLEDAN  [LED5MMRGB]
U$462  RGBLEDAN  [LED5MMRGB]
U$463  RGBLEDAN  [LED5MMRGB]
U$464  RGBLEDAN  [LED5MMRGB]
U$465  RGBLEDAN  [LED5MMRGB]
U$466  RGBLEDAN  [LED5MMRGB]
U$467  RGBLEDAN  [LED5MMRGB]
U$468  RGBLEDAN  [LED5MMRGB]
U$469  RGBLEDAN  [LED5MMRGB]
U$470  RGBLEDAN  [LED5MMRGB]
U$471  RGBLEDAN  [LED5MMRGB]
U$472  RGBLEDAN  [LED5MMRGB]
U$473  RGBLEDAN  [LED5MMRGB]
U$474  RGBLEDAN  [LED5MMRGB]
U$475  RGBLEDAN  [LED5MMRGB]
U$476  RGBLEDAN  [LED5MMRGB]
U$477  RGBLEDAN  [LED5MMRGB]
U$478  RGBLEDAN  [LED5MMRGB]
U$479  RGBLEDAN  [LED5MMRGB]
U$480  RGBLEDAN  [LED5MMRGB]
U$481  RGBLEDAN  [LED5MMRGB]
U$482  RGBLEDAN  [LED5MMRGB]
U$483  RGBLEDAN  [LED5MMRGB]
U$484  RGBLEDAN  [LED5MMRGB]
U$485  RGBLEDAN  [LED5MMRGB]
U$486  RGBLEDAN  [LED5MMRGB]
U$487  RGBLEDAN  [LED5MMRGB]
U$488  RGBLEDAN  [LED5MMRGB]
U$489  RGBLEDAN  [LED5MMRGB]
U$490  RGBLEDAN  [LED5MMRGB]
U$491  RGBLEDAN  [LED5MMRGB]
U$492  RGBLEDAN  [LED5MMRGB]
U$493  RGBLEDAN  [LED5MMRGB]
U$494  RGBLEDAN  [LED5MMRGB]
U$495  RGBLEDAN  [LED5MMRGB]
U$496  RGBLEDAN  [LED5MMRGB]
U$497  RGBLEDAN  [LED5MMRGB]
U$498  RGBLEDAN  [LED5MMRGB]
U$499  RGBLEDAN  [LED5MMRGB]
U$500  RGBLEDAN  [LED5MMRGB]
U$501  RGBLEDAN  [LED5MMRGB]
U$502  RGBLEDAN  [LED5MMRGB]
U$503  RGBLEDAN  [LED5MMRGB]
U$504  RGBLEDAN  [LED5MMRGB]
U$505  RGBLEDAN  [LED5MMRGB]
U$506  RGBLEDAN  [LED5MMRGB]
U$507  RGBLEDAN  [LED5MMRGB]
U$508  RGBLEDAN  [LED5MMRGB]
U$509  RGBLEDAN  [LED5MMRGB]
U$510  RGBLEDAN  [LED5MMRGB]
U$511  RGBLEDAN  [LED5MMRGB]
U$512  RGBLEDAN  [LED5MMRGB]
U$513  RGBLEDAN  [LED5MMRGB]
U$514  RGBLEDAN  [LED5MMRGB]
U$515  RGBLEDAN  [LED5MMRGB]
U$516  RGBLEDAN  [LED5MMRGB]
U$517  RGBLEDAN  [LED5MMRGB]
U$518  RGBLEDAN  [LED5MMRGB]
U$519  2.1MMJACKTHM  [PJ-102A]

## Nets
+5V: C1.1 C2.1 C3.1 C4.1 C5.1 C6.1 C7.1 C8.1 C9.1 C10.1 C11.1 C12.1 C13.1 C14.1 C15.1 C16.1 C18.+ IC1.16(VDD) IC2.16(VDD) IC3.2(VO) Q17.1(S) Q18.1(S) Q19.1(S) Q20.1(S) Q21.1(S) Q22.1(S) Q23.1(S) Q24.1(S) Q25.1(S) Q26.1(S) Q27.1(S) Q28.1(S) Q29.1(S) Q30.1(S) Q31.1(S) Q32.1(S) U$1.21(VCC) U$2.21(VCC) U$3.21(VCC) U$4.21(VCC) U$5.21(VCC) U$6.21(VCC)
BLANK: TLCPINS.6 U$1.23(BLANK) U$2.23(BLANK) U$3.23(BLANK) U$4.23(BLANK) U$5.23(BLANK) U$6.23(BLANK)
GND: C1.2 C2.2 C3.2 C4.2 C5.2 C6.2 C7.2 C8.2 C9.2 C10.2 C11.2 C12.2 C13.2 C14.2 C15.2 C16.2 C17.- C18.- IC1.8(VSS) IC2.8(VSS) IC3.1(ADJ) R1.2 R2.2 R3.2 R4.2 R5.2 R6.2 R7.1 R8.1 R9.1 R10.1 R11.1 R12.1 R13.1 R14.1 R15.1 R16.1 R17.1 R18.1 R19.1 R20.1 R21.1 R22.1 SHIFTPINS.1 SHIFTPINS.2 U$1.22(GND) U$2.22(GND) U$3.22(GND) U$4.22(GND) U$5.22(GND) U$6.22(GND) U$519.RING U$519.RING_SW
GSCLK: TLCPINS.4 U$1.18(GSCLK) U$2.18(GSCLK) U$3.18(GSCLK) U$4.18(GSCLK) U$5.18(GSCLK) U$6.18(GSCLK)
N$1: IC1.5(Q2) Q18.2(G) R8.2
N$2: Q18.3(D) U$39.2(V) U$40.2(V) U$41.2(V) U$42.2(V) U$43.2(V) U$44.2(V) U$45.2(V) U$46.2(V) U$47.2(V) U$48.2(V) U$49.2(V) U$50.2(V) U$51.2(V) U$52.2(V) U$53.2(V) U$54.2(V) U$55.2(V) U$56.2(V) U$57.2(V) U$58.2(V) U$59.2(V) U$60.2(V) U$61.2(V) U$62.2(V) U$63.2(V) U$64.2(V) U$65.2(V) U$66.2(V) U$67.2(V) U$68.2(V) U$69.2(V) U$70.2(V)
N$3: IC1.6(Q3) Q19.2(G) R9.2
N$4: Q19.3(D) U$71.2(V) U$72.2(V) U$73.2(V) U$74.2(V) U$75.2(V) U$76.2(V) U$77.2(V) U$78.2(V) U$79.2(V) U$80.2(V) U$81.2(V) U$82.2(V) U$83.2(V) U$84.2(V) U$85.2(V) U$86.2(V) U$87.2(V) U$88.2(V) U$89.2(V) U$90.2(V) U$91.2(V) U$92.2(V) U$93.2(V) U$94.2(V) U$95.2(V) U$96.2(V) U$97.2(V) U$98.2(V) U$99.2(V) U$100.2(V) U$101.2(V) U$102.2(V)
N$5: IC1.7(Q4) Q20.2(G) R10.2
N$6: Q20.3(D) U$103.2(V) U$104.2(V) U$105.2(V) U$106.2(V) U$107.2(V) U$108.2(V) U$109.2(V) U$110.2(V) U$111.2(V) U$112.2(V) U$113.2(V) U$114.2(V) U$115.2(V) U$116.2(V) U$117.2(V) U$118.2(V) U$119.2(V) U$120.2(V) U$121.2(V) U$122.2(V) U$123.2(V) U$124.2(V) U$125.2(V) U$126.2(V) U$127.2(V) U$128.2(V) U$129.2(V) U$130.2(V) U$131.2(V) U$132.2(V) U$133.2(V) U$134.2(V)
N$7: IC1.14(Q5) Q21.2(G) R11.2
N$8: Q21.3(D) U$135.2(V) U$136.2(V) U$137.2(V) U$138.2(V) U$139.2(V) U$140.2(V) U$141.2(V) U$142.2(V) U$143.2(V) U$144.2(V) U$145.2(V) U$146.2(V) U$147.2(V) U$148.2(V) U$149.2(V) U$150.2(V) U$151.2(V) U$152.2(V) U$153.2(V) U$154.2(V) U$155.2(V) U$156.2(V) U$157.2(V) U$158.2(V) U$159.2(V) U$160.2(V) U$161.2(V) U$162.2(V) U$163.2(V) U$164.2(V) U$165.2(V) U$166.2(V)
N$9: IC1.13(Q6) Q22.2(G) R12.2
N$10: Q22.3(D) U$167.2(V) U$168.2(V) U$169.2(V) U$170.2(V) U$171.2(V) U$172.2(V) U$173.2(V) U$174.2(V) U$175.2(V) U$176.2(V) U$177.2(V) U$178.2(V) U$179.2(V) U$180.2(V) U$181.2(V) U$182.2(V) U$183.2(V) U$184.2(V) U$185.2(V) U$186.2(V) U$187.2(V) U$188.2(V) U$189.2(V) U$190.2(V) U$191.2(V) U$192.2(V) U$193.2(V) U$194.2(V) U$195.2(V) U$196.2(V) U$197.2(V) U$198.2(V)
N$11: IC1.12(Q7) Q23.2(G) R13.2
N$12: Q23.3(D) U$199.2(V) U$200.2(V) U$201.2(V) U$202.2(V) U$203.2(V) U$204.2(V) U$205.2(V) U$206.2(V) U$207.2(V) U$208.2(V) U$209.2(V) U$210.2(V) U$211.2(V) U$212.2(V) U$213.2(V) U$214.2(V) U$215.2(V) U$216.2(V) U$217.2(V) U$218.2(V) U$219.2(V) U$220.2(V) U$221.2(V) U$222.2(V) U$223.2(V) U$224.2(V) U$225.2(V) U$226.2(V) U$227.2(V) U$228.2(V) U$229.2(V) U$230.2(V)
N$13: IC1.11(Q8) Q24.2(G) R14.2
N$14: Q24.3(D) U$231.2(V) U$232.2(V) U$233.2(V) U$234.2(V) U$235.2(V) U$236.2(V) U$237.2(V) U$238.2(V) U$239.2(V) U$240.2(V) U$241.2(V) U$242.2(V) U$243.2(V) U$244.2(V) U$245.2(V) U$246.2(V) U$247.2(V) U$248.2(V) U$249.2(V) U$250.2(V) U$251.2(V) U$252.2(V) U$253.2(V) U$254.2(V) U$255.2(V) U$256.2(V) U$257.2(V) U$258.2(V) U$259.2(V) U$260.2(V) U$261.2(V) U$262.2(V)
N$15: IC2.4(Q1) Q25.2(G) R15.2
N$16: IC1.4(Q1) Q17.2(G) R7.2
N$17: Q17.3(D) U$7.2(V) U$8.2(V) U$9.2(V) U$10.2(V) U$11.2(V) U$12.2(V) U$13.2(V) U$14.2(V) U$15.2(V) U$16.2(V) U$17.2(V) U$18.2(V) U$19.2(V) U$20.2(V) U$21.2(V) U$22.2(V) U$23.2(V) U$24.2(V) U$25.2(V) U$26.2(V) U$27.2(V) U$28.2(V) U$29.2(V) U$30.2(V) U$31.2(V) U$32.2(V) U$33.2(V) U$34.2(V) U$35.2(V) U$36.2(V) U$37.2(V) U$38.2(V)
N$18: Q25.3(D) U$263.2(V) U$264.2(V) U$265.2(V) U$266.2(V) U$267.2(V) U$268.2(V) U$269.2(V) U$270.2(V) U$271.2(V) U$272.2(V) U$273.2(V) U$274.2(V) U$275.2(V) U$276.2(V) U$277.2(V) U$278.2(V) U$279.2(V) U$280.2(V) U$281.2(V) U$282.2(V) U$283.2(V) U$284.2(V) U$285.2(V) U$286.2(V) U$287.2(V) U$288.2(V) U$289.2(V) U$290.2(V) U$291.2(V) U$292.2(V) U$293.2(V) U$294.2(V)
N$19: IC2.5(Q2) Q26.2(G) R16.2
N$20: Q26.3(D) U$295.2(V) U$296.2(V) U$297.2(V) U$298.2(V) U$299.2(V) U$300.2(V) U$301.2(V) U$302.2(V) U$303.2(V) U$304.2(V) U$305.2(V) U$306.2(V) U$307.2(V) U$308.2(V) U$309.2(V) U$310.2(V) U$311.2(V) U$312.2(V) U$313.2(V) U$314.2(V) U$315.2(V) U$316.2(V) U$317.2(V) U$318.2(V) U$319.2(V) U$320.2(V) U$321.2(V) U$322.2(V) U$323.2(V) U$324.2(V) U$325.2(V) U$326.2(V)
N$21: IC2.6(Q3) Q27.2(G) R17.2
N$22: Q27.3(D) U$327.2(V) U$328.2(V) U$329.2(V) U$330.2(V) U$331.2(V) U$332.2(V) U$333.2(V) U$334.2(V) U$335.2(V) U$336.2(V) U$337.2(V) U$338.2(V) U$339.2(V) U$340.2(V) U$341.2(V) U$342.2(V) U$343.2(V) U$344.2(V) U$345.2(V) U$346.2(V) U$347.2(V) U$348.2(V) U$349.2(V) U$350.2(V) U$351.2(V) U$352.2(V) U$353.2(V) U$354.2(V) U$355.2(V) U$356.2(V) U$357.2(V) U$358.2(V)
N$23: IC2.7(Q4) Q28.2(G) R18.2
N$24: Q28.3(D) U$359.2(V) U$360.2(V) U$361.2(V) U$362.2(V) U$363.2(V) U$364.2(V) U$365.2(V) U$366.2(V) U$367.2(V) U$368.2(V) U$369.2(V) U$370.2(V) U$371.2(V) U$372.2(V) U$373.2(V) U$374.2(V) U$375.2(V) U$376.2(V) U$377.2(V) U$378.2(V) U$379.2(V) U$380.2(V) U$381.2(V) U$382.2(V) U$383.2(V) U$384.2(V) U$385.2(V) U$386.2(V) U$387.2(V) U$388.2(V) U$389.2(V) U$390.2(V)
N$25: IC2.14(Q5) Q29.2(G) R19.2
N$26: Q29.3(D) U$391.2(V) U$392.2(V) U$393.2(V) U$394.2(V) U$395.2(V) U$396.2(V) U$397.2(V) U$398.2(V) U$399.2(V) U$400.2(V) U$401.2(V) U$402.2(V) U$403.2(V) U$404.2(V) U$405.2(V) U$406.2(V) U$407.2(V) U$408.2(V) U$409.2(V) U$410.2(V) U$411.2(V) U$412.2(V) U$413.2(V) U$414.2(V) U$415.2(V) U$416.2(V) U$417.2(V) U$418.2(V) U$419.2(V) U$420.2(V) U$421.2(V) U$422.2(V)
N$27: IC2.13(Q6) Q30.2(G) R20.2
N$28: Q30.3(D) U$423.2(V) U$424.2(V) U$425.2(V) U$426.2(V) U$427.2(V) U$428.2(V) U$429.2(V) U$430.2(V) U$431.2(V) U$432.2(V) U$433.2(V) U$434.2(V) U$435.2(V) U$436.2(V) U$437.2(V) U$438.2(V) U$439.2(V) U$440.2(V) U$441.2(V) U$442.2(V) U$443.2(V) U$444.2(V) U$445.2(V) U$446.2(V) U$447.2(V) U$448.2(V) U$449.2(V) U$450.2(V) U$451.2(V) U$452.2(V) U$453.2(V) U$454.2(V)
N$29: IC2.12(Q7) Q31.2(G) R21.2
N$30: Q31.3(D) U$455.2(V) U$456.2(V) U$457.2(V) U$458.2(V) U$459.2(V) U$460.2(V) U$461.2(V) U$462.2(V) U$463.2(V) U$464.2(V) U$465.2(V) U$466.2(V) U$467.2(V) U$468.2(V) U$469.2(V) U$470.2(V) U$471.2(V) U$472.2(V) U$473.2(V) U$474.2(V) U$475.2(V) U$476.2(V) U$477.2(V) U$478.2(V) U$479.2(V) U$480.2(V) U$481.2(V) U$482.2(V) U$483.2(V) U$484.2(V) U$485.2(V) U$486.2(V)
N$31: IC2.11(Q8) Q32.2(G) R22.2
N$32: Q32.3(D) U$487.2(V) U$488.2(V) U$489.2(V) U$490.2(V) U$491.2(V) U$492.2(V) U$493.2(V) U$494.2(V) U$495.2(V) U$496.2(V) U$497.2(V) U$498.2(V) U$499.2(V) U$500.2(V) U$501.2(V) U$502.2(V) U$503.2(V) U$504.2(V) U$505.2(V) U$506.2(V) U$507.2(V) U$508.2(V) U$509.2(V) U$510.2(V) U$511.2(V) U$512.2(V) U$513.2(V) U$514.2(V) U$515.2(V) U$516.2(V) U$517.2(V) U$518.2(V)
N$33: U$1.28(OUT0) U$7.1(RED) U$39.1(RED) U$71.1(RED) U$103.1(RED) U$135.1(RED) U$167.1(RED) U$199.1(RED) U$231.1(RED) U$263.1(RED) U$295.1(RED) U$327.1(RED) U$359.1(RED) U$391.1(RED) U$423.1(RED) U$455.1(RED) U$487.1(RED)
N$34: U$1.1(OUT1) U$7.3(GREEN) U$39.3(GREEN) U$71.3(GREEN) U$103.3(GREEN) U$135.3(GREEN) U$167.3(GREEN) U$199.3(GREEN) U$231.3(GREEN) U$263.3(GREEN) U$295.3(GREEN) U$327.3(GREEN) U$359.3(GREEN) U$391.3(GREEN) U$423.3(GREEN) U$455.3(GREEN) U$487.3(GREEN)
N$35: U$1.2(OUT2) U$7.4(BLUE) U$39.4(BLUE) U$71.4(BLUE) U$103.4(BLUE) U$135.4(BLUE) U$167.4(BLUE) U$199.4(BLUE) U$231.4(BLUE) U$263.4(BLUE) U$295.4(BLUE) U$327.4(BLUE) U$359.4(BLUE) U$391.4(BLUE) U$423.4(BLUE) U$455.4(BLUE) U$487.4(BLUE)
N$36: U$1.3(OUT3) U$8.1(RED) U$40.1(RED) U$72.1(RED) U$104.1(RED) U$136.1(RED) U$168.1(RED) U$200.1(RED) U$232.1(RED) U$264.1(RED) U$296.1(RED) U$328.1(RED) U$360.1(RED) U$392.1(RED) U$424.1(RED) U$456.1(RED) U$488.1(RED)
N$37: IC1.9(QS) IC2.2(D)
N$38: U$1.4(OUT4) U$8.3(GREEN) U$40.3(GREEN) U$72.3(GREEN) U$104.3(GREEN) U$136.3(GREEN) U$168.3(GREEN) U$200.3(GREEN) U$232.3(GREEN) U$264.3(GREEN) U$296.3(GREEN) U$328.3(GREEN) U$360.3(GREEN) U$392.3(GREEN) U$424.3(GREEN) U$456.3(GREEN) U$488.3(GREEN)
N$39: U$1.5(OUT5) U$8.4(BLUE) U$40.4(BLUE) U$72.4(BLUE) U$104.4(BLUE) U$136.4(BLUE) U$168.4(BLUE) U$200.4(BLUE) U$232.4(BLUE) U$264.4(BLUE) U$296.4(BLUE) U$328.4(BLUE) U$360.4(BLUE) U$392.4(BLUE) U$424.4(BLUE) U$456.4(BLUE) U$488.4(BLUE)
N$40: U$1.6(OUT6) U$9.1(RED) U$41.1(RED) U$73.1(RED) U$105.1(RED) U$137.1(RED) U$169.1(RED) U$201.1(RED) U$233.1(RED) U$265.1(RED) U$297.1(RED) U$329.1(RED) U$361.1(RED) U$393.1(RED) U$425.1(RED) U$457.1(RED) U$489.1(RED)
N$41: U$1.7(OUT7) U$9.3(GREEN) U$41.3(GREEN) U$73.3(GREEN) U$105.3(GREEN) U$137.3(GREEN) U$169.3(GREEN) U$201.3(GREEN) U$233.3(GREEN) U$265.3(GREEN) U$297.3(GREEN) U$329.3(GREEN) U$361.3(GREEN) U$393.3(GREEN) U$425.3(GREEN) U$457.3(GREEN) U$489.3(GREEN)
N$42: U$1.8(OUT8) U$9.4(BLUE) U$41.4(BLUE) U$73.4(BLUE) U$105.4(BLUE) U$137.4(BLUE) U$169.4(BLUE) U$201.4(BLUE) U$233.4(BLUE) U$265.4(BLUE) U$297.4(BLUE) U$329.4(BLUE) U$361.4(BLUE) U$393.4(BLUE) U$425.4(BLUE) U$457.4(BLUE) U$489.4(BLUE)
N$43: U$1.9(OUT9) U$10.1(RED) U$42.1(RED) U$74.1(RED) U$106.1(RED) U$138.1(RED) U$170.1(RED) U$202.1(RED) U$234.1(RED) U$266.1(RED) U$298.1(RED) U$330.1(RED) U$362.1(RED) U$394.1(RED) U$426.1(RED) U$458.1(RED) U$490.1(RED)
N$44: U$1.10(OUT10) U$10.3(GREEN) U$42.3(GREEN) U$74.3(GREEN) U$106.3(GREEN) U$138.3(GREEN) U$170.3(GREEN) U$202.3(GREEN) U$234.3(GREEN) U$266.3(GREEN) U$298.3(GREEN) U$330.3(GREEN) U$362.3(GREEN) U$394.3(GREEN) U$426.3(GREEN) U$458.3(GREEN) U$490.3(GREEN)
N$45: U$1.11(OUT11) U$10.4(BLUE) U$42.4(BLUE) U$74.4(BLUE) U$106.4(BLUE) U$138.4(BLUE) U$170.4(BLUE) U$202.4(BLUE) U$234.4(BLUE) U$266.4(BLUE) U$298.4(BLUE) U$330.4(BLUE) U$362.4(BLUE) U$394.4(BLUE) U$426.4(BLUE) U$458.4(BLUE) U$490.4(BLUE)
N$46: U$1.12(OUT12) U$11.1(RED) U$43.1(RED) U$75.1(RED) U$107.1(RED) U$139.1(RED) U$171.1(RED) U$203.1(RED) U$235.1(RED) U$267.1(RED) U$299.1(RED) U$331.1(RED) U$363.1(RED) U$395.1(RED) U$427.1(RED) U$459.1(RED) U$491.1(RED)
N$47: U$1.13(OUT13) U$11.3(GREEN) U$43.3(GREEN) U$75.3(GREEN) U$107.3(GREEN) U$139.3(GREEN) U$171.3(GREEN) U$203.3(GREEN) U$235.3(GREEN) U$267.3(GREEN) U$299.3(GREEN) U$331.3(GREEN) U$363.3(GREEN) U$395.3(GREEN) U$427.3(GREEN) U$459.3(GREEN) U$491.3(GREEN)
N$48: U$1.14(OUT14) U$11.4(BLUE) U$43.4(BLUE) U$75.4(BLUE) U$107.4(BLUE) U$139.4(BLUE) U$171.4(BLUE) U$203.4(BLUE) U$235.4(BLUE) U$267.4(BLUE) U$299.4(BLUE) U$331.4(BLUE) U$363.4(BLUE) U$395.4(BLUE) U$427.4(BLUE) U$459.4(BLUE) U$491.4(BLUE)
N$49: U$1.15(OUT15) U$12.1(RED) U$44.1(RED) U$76.1(RED) U$108.1(RED) U$140.1(RED) U$172.1(RED) U$204.1(RED) U$236.1(RED) U$268.1(RED) U$300.1(RED) U$332.1(RED) U$364.1(RED) U$396.1(RED) U$428.1(RED) U$460.1(RED) U$492.1(RED)
N$50: U$2.28(OUT0) U$12.3(GREEN) U$44.3(GREEN) U$76.3(GREEN) U$108.3(GREEN) U$140.3(GREEN) U$172.3(GREEN) U$204.3(GREEN) U$236.3(GREEN) U$268.3(GREEN) U$300.3(GREEN) U$332.3(GREEN) U$364.3(GREEN) U$396.3(GREEN) U$428.3(GREEN) U$460.3(GREEN) U$492.3(GREEN)
N$51: U$2.1(OUT1) U$12.4(BLUE) U$44.4(BLUE) U$76.4(BLUE) U$108.4(BLUE) U$140.4(BLUE) U$172.4(BLUE) U$204.4(BLUE) U$236.4(BLUE) U$268.4(BLUE) U$300.4(BLUE) U$332.4(BLUE) U$364.4(BLUE) U$396.4(BLUE) U$428.4(BLUE) U$460.4(BLUE) U$492.4(BLUE)
N$52: U$2.2(OUT2) U$13.1(RED) U$45.1(RED) U$77.1(RED) U$109.1(RED) U$141.1(RED) U$173.1(RED) U$205.1(RED) U$237.1(RED) U$269.1(RED) U$301.1(RED) U$333.1(RED) U$365.1(RED) U$397.1(RED) U$429.1(RED) U$461.1(RED) U$493.1(RED)
N$53: U$2.3(OUT3) U$13.3(GREEN) U$45.3(GREEN) U$77.3(GREEN) U$109.3(GREEN) U$141.3(GREEN) U$173.3(GREEN) U$205.3(GREEN) U$237.3(GREEN) U$269.3(GREEN) U$301.3(GREEN) U$333.3(GREEN) U$365.3(GREEN) U$397.3(GREEN) U$429.3(GREEN) U$461.3(GREEN) U$493.3(GREEN)
N$54: U$2.4(OUT4) U$13.4(BLUE) U$45.4(BLUE) U$77.4(BLUE) U$109.4(BLUE) U$141.4(BLUE) U$173.4(BLUE) U$205.4(BLUE) U$237.4(BLUE) U$269.4(BLUE) U$301.4(BLUE) U$333.4(BLUE) U$365.4(BLUE) U$397.4(BLUE) U$429.4(BLUE) U$461.4(BLUE) U$493.4(BLUE)
N$55: U$2.5(OUT5) U$14.1(RED) U$46.1(RED) U$78.1(RED) U$110.1(RED) U$142.1(RED) U$174.1(RED) U$206.1(RED) U$238.1(RED) U$270.1(RED) U$302.1(RED) U$334.1(RED) U$366.1(RED) U$398.1(RED) U$430.1(RED) U$462.1(RED) U$494.1(RED)
N$56: U$2.6(OUT6) U$14.3(GREEN) U$46.3(GREEN) U$78.3(GREEN) U$110.3(GREEN) U$142.3(GREEN) U$174.3(GREEN) U$206.3(GREEN) U$238.3(GREEN) U$270.3(GREEN) U$302.3(GREEN) U$334.3(GREEN) U$366.3(GREEN) U$398.3(GREEN) U$430.3(GREEN) U$462.3(GREEN) U$494.3(GREEN)
N$57: U$2.7(OUT7) U$14.4(BLUE) U$46.4(BLUE) U$78.4(BLUE) U$110.4(BLUE) U$142.4(BLUE) U$174.4(BLUE) U$206.4(BLUE) U$238.4(BLUE) U$270.4(BLUE) U$302.4(BLUE) U$334.4(BLUE) U$366.4(BLUE) U$398.4(BLUE) U$430.4(BLUE) U$462.4(BLUE) U$494.4(BLUE)
N$58: U$2.8(OUT8) U$15.1(RED) U$47.1(RED) U$79.1(RED) U$111.1(RED) U$143.1(RED) U$175.1(RED) U$207.1(RED) U$239.1(RED) U$271.1(RED) U$303.1(RED) U$335.1(RED) U$367.1(RED) U$399.1(RED) U$431.1(RED) U$463.1(RED) U$495.1(RED)
N$59: U$2.9(OUT9) U$15.3(GREEN) U$47.3(GREEN) U$79.3(GREEN) U$111.3(GREEN) U$143.3(GREEN) U$175.3(GREEN) U$207.3(GREEN) U$239.3(GREEN) U$271.3(GREEN) U$303.3(GREEN) U$335.3(GREEN) U$367.3(GREEN) U$399.3(GREEN) U$431.3(GREEN) U$463.3(GREEN) U$495.3(GREEN)
N$60: U$2.10(OUT10) U$15.4(BLUE) U$47.4(BLUE) U$79.4(BLUE) U$111.4(BLUE) U$143.4(BLUE) U$175.4(BLUE) U$207.4(BLUE) U$239.4(BLUE) U$271.4(BLUE) U$303.4(BLUE) U$335.4(BLUE) U$367.4(BLUE) U$399.4(BLUE) U$431.4(BLUE) U$463.4(BLUE) U$495.4(BLUE)
N$61: U$2.11(OUT11) U$16.1(RED) U$48.1(RED) U$80.1(RED) U$112.1(RED) U$144.1(RED) U$176.1(RED) U$208.1(RED) U$240.1(RED) U$272.1(RED) U$304.1(RED) U$336.1(RED) U$368.1(RED) U$400.1(RED) U$432.1(RED) U$464.1(RED) U$496.1(RED)
N$62: U$2.12(OUT12) U$16.3(GREEN) U$48.3(GREEN) U$80.3(GREEN) U$112.3(GREEN) U$144.3(GREEN) U$176.3(GREEN) U$208.3(GREEN) U$240.3(GREEN) U$272.3(GREEN) U$304.3(GREEN) U$336.3(GREEN) U$368.3(GREEN) U$400.3(GREEN) U$432.3(GREEN) U$464.3(GREEN) U$496.3(GREEN)
N$63: U$2.13(OUT13) U$16.4(BLUE) U$48.4(BLUE) U$80.4(BLUE) U$112.4(BLUE) U$144.4(BLUE) U$176.4(BLUE) U$208.4(BLUE) U$240.4(BLUE) U$272.4(BLUE) U$304.4(BLUE) U$336.4(BLUE) U$368.4(BLUE) U$400.4(BLUE) U$432.4(BLUE) U$464.4(BLUE) U$496.4(BLUE)
N$64: U$2.14(OUT14) U$17.1(RED) U$49.1(RED) U$81.1(RED) U$113.1(RED) U$145.1(RED) U$177.1(RED) U$209.1(RED) U$241.1(RED) U$273.1(RED) U$305.1(RED) U$337.1(RED) U$369.1(RED) U$401.1(RED) U$433.1(RED) U$465.1(RED) U$497.1(RED)
N$65: U$2.15(OUT15) U$17.3(GREEN) U$49.3(GREEN) U$81.3(GREEN) U$113.3(GREEN) U$145.3(GREEN) U$177.3(GREEN) U$209.3(GREEN) U$241.3(GREEN) U$273.3(GREEN) U$305.3(GREEN) U$337.3(GREEN) U$369.3(GREEN) U$401.3(GREEN) U$433.3(GREEN) U$465.3(GREEN) U$497.3(GREEN)
N$66: U$3.28(OUT0) U$17.4(BLUE) U$49.4(BLUE) U$81.4(BLUE) U$113.4(BLUE) U$145.4(BLUE) U$177.4(BLUE) U$209.4(BLUE) U$241.4(BLUE) U$273.4(BLUE) U$305.4(BLUE) U$337.4(BLUE) U$369.4(BLUE) U$401.4(BLUE) U$433.4(BLUE) U$465.4(BLUE) U$497.4(BLUE)
N$67: U$3.1(OUT1) U$18.1(RED) U$50.1(RED) U$82.1(RED) U$114.1(RED) U$146.1(RED) U$178.1(RED) U$210.1(RED) U$242.1(RED) U$274.1(RED) U$306.1(RED) U$338.1(RED) U$370.1(RED) U$402.1(RED) U$434.1(RED) U$466.1(RED) U$498.1(RED)
N$68: U$3.2(OUT2) U$18.3(GREEN) U$50.3(GREEN) U$82.3(GREEN) U$114.3(GREEN) U$146.3(GREEN) U$178.3(GREEN) U$210.3(GREEN) U$242.3(GREEN) U$274.3(GREEN) U$306.3(GREEN) U$338.3(GREEN) U$370.3(GREEN) U$402.3(GREEN) U$434.3(GREEN) U$466.3(GREEN) U$498.3(GREEN)
N$69: U$3.3(OUT3) U$18.4(BLUE) U$50.4(BLUE) U$82.4(BLUE) U$114.4(BLUE) U$146.4(BLUE) U$178.4(BLUE) U$210.4(BLUE) U$242.4(BLUE) U$274.4(BLUE) U$306.4(BLUE) U$338.4(BLUE) U$370.4(BLUE) U$402.4(BLUE) U$434.4(BLUE) U$466.4(BLUE) U$498.4(BLUE)
N$70: U$3.4(OUT4) U$19.1(RED) U$51.1(RED) U$83.1(RED) U$115.1(RED) U$147.1(RED) U$179.1(RED) U$211.1(RED) U$243.1(RED) U$275.1(RED) U$307.1(RED) U$339.1(RED) U$371.1(RED) U$403.1(RED) U$435.1(RED) U$467.1(RED) U$499.1(RED)
N$71: U$3.5(OUT5) U$19.3(GREEN) U$51.3(GREEN) U$83.3(GREEN) U$115.3(GREEN) U$147.3(GREEN) U$179.3(GREEN) U$211.3(GREEN) U$243.3(GREEN) U$275.3(GREEN) U$307.3(GREEN) U$339.3(GREEN) U$371.3(GREEN) U$403.3(GREEN) U$435.3(GREEN) U$467.3(GREEN) U$499.3(GREEN)
N$72: U$3.6(OUT6) U$19.4(BLUE) U$51.4(BLUE) U$83.4(BLUE) U$115.4(BLUE) U$147.4(BLUE) U$179.4(BLUE) U$211.4(BLUE) U$243.4(BLUE) U$275.4(BLUE) U$307.4(BLUE) U$339.4(BLUE) U$371.4(BLUE) U$403.4(BLUE) U$435.4(BLUE) U$467.4(BLUE) U$499.4(BLUE)
N$73: U$3.7(OUT7) U$20.1(RED) U$52.1(RED) U$84.1(RED) U$116.1(RED) U$148.1(RED) U$180.1(RED) U$212.1(RED) U$244.1(RED) U$276.1(RED) U$308.1(RED) U$340.1(RED) U$372.1(RED) U$404.1(RED) U$436.1(RED) U$468.1(RED) U$500.1(RED)
N$74: U$3.8(OUT8) U$20.3(GREEN) U$52.3(GREEN) U$84.3(GREEN) U$116.3(GREEN) U$148.3(GREEN) U$180.3(GREEN) U$212.3(GREEN) U$244.3(GREEN) U$276.3(GREEN) U$308.3(GREEN) U$340.3(GREEN) U$372.3(GREEN) U$404.3(GREEN) U$436.3(GREEN) U$468.3(GREEN) U$500.3(GREEN)
N$75: U$3.9(OUT9) U$20.4(BLUE) U$52.4(BLUE) U$84.4(BLUE) U$116.4(BLUE) U$148.4(BLUE) U$180.4(BLUE) U$212.4(BLUE) U$244.4(BLUE) U$276.4(BLUE) U$308.4(BLUE) U$340.4(BLUE) U$372.4(BLUE) U$404.4(BLUE) U$436.4(BLUE) U$468.4(BLUE) U$500.4(BLUE)
N$76: U$3.10(OUT10) U$21.1(RED) U$53.1(RED) U$85.1(RED) U$117.1(RED) U$149.1(RED) U$181.1(RED) U$213.1(RED) U$245.1(RED) U$277.1(RED) U$309.1(RED) U$341.1(RED) U$373.1(RED) U$405.1(RED) U$437.1(RED) U$469.1(RED) U$501.1(RED)
N$77: U$3.11(OUT11) U$21.3(GREEN) U$53.3(GREEN) U$85.3(GREEN) U$117.3(GREEN) U$149.3(GREEN) U$181.3(GREEN) U$213.3(GREEN) U$245.3(GREEN) U$277.3(GREEN) U$309.3(GREEN) U$341.3(GREEN) U$373.3(GREEN) U$405.3(GREEN) U$437.3(GREEN) U$469.3(GREEN) U$501.3(GREEN)
N$78: U$3.12(OUT12) U$21.4(BLUE) U$53.4(BLUE) U$85.4(BLUE) U$117.4(BLUE) U$149.4(BLUE) U$181.4(BLUE) U$213.4(BLUE) U$245.4(BLUE) U$277.4(BLUE) U$309.4(BLUE) U$341.4(BLUE) U$373.4(BLUE) U$405.4(BLUE) U$437.4(BLUE) U$469.4(BLUE) U$501.4(BLUE)
N$79: U$3.13(OUT13) U$22.1(RED) U$54.1(RED) U$86.1(RED) U$118.1(RED) U$150.1(RED) U$182.1(RED) U$214.1(RED) U$246.1(RED) U$278.1(RED) U$310.1(RED) U$342.1(RED) U$374.1(RED) U$406.1(RED) U$438.1(RED) U$470.1(RED) U$502.1(RED)
N$80: U$3.14(OUT14) U$22.3(GREEN) U$54.3(GREEN) U$86.3(GREEN) U$118.3(GREEN) U$150.3(GREEN) U$182.3(GREEN) U$214.3(GREEN) U$246.3(GREEN) U$278.3(GREEN) U$310.3(GREEN) U$342.3(GREEN) U$374.3(GREEN) U$406.3(GREEN) U$438.3(GREEN) U$470.3(GREEN) U$502.3(GREEN)
N$81: U$3.15(OUT15) U$22.4(BLUE) U$54.4(BLUE) U$86.4(BLUE) U$118.4(BLUE) U$150.4(BLUE) U$182.4(BLUE) U$214.4(BLUE) U$246.4(BLUE) U$278.4(BLUE) U$310.4(BLUE) U$342.4(BLUE) U$374.4(BLUE) U$406.4(BLUE) U$438.4(BLUE) U$470.4(BLUE) U$502.4(BLUE)
N$82: U$4.28(OUT0) U$23.1(RED) U$55.1(RED) U$87.1(RED) U$119.1(RED) U$151.1(RED) U$183.1(RED) U$215.1(RED) U$247.1(RED) U$279.1(RED) U$311.1(RED) U$343.1(RED) U$375.1(RED) U$407.1(RED) U$439.1(RED) U$471.1(RED) U$503.1(RED)
N$83: U$4.1(OUT1) U$23.3(GREEN) U$55.3(GREEN) U$87.3(GREEN) U$119.3(GREEN) U$151.3(GREEN) U$183.3(GREEN) U$215.3(GREEN) U$247.3(GREEN) U$279.3(GREEN) U$311.3(GREEN) U$343.3(GREEN) U$375.3(GREEN) U$407.3(GREEN) U$439.3(GREEN) U$471.3(GREEN) U$503.3(GREEN)
N$84: U$4.2(OUT2) U$23.4(BLUE) U$55.4(BLUE) U$87.4(BLUE) U$119.4(BLUE) U$151.4(BLUE) U$183.4(BLUE) U$215.4(BLUE) U$247.4(BLUE) U$279.4(BLUE) U$311.4(BLUE) U$343.4(BLUE) U$375.4(BLUE) U$407.4(BLUE) U$439.4(BLUE) U$471.4(BLUE) U$503.4(BLUE)
N$85: U$4.3(OUT3) U$24.1(RED) U$56.1(RED) U$88.1(RED) U$120.1(RED) U$152.1(RED) U$184.1(RED) U$216.1(RED) U$248.1(RED) U$280.1(RED) U$312.1(RED) U$344.1(RED) U$376.1(RED) U$408.1(RED) U$440.1(RED) U$472.1(RED) U$504.1(RED)
N$86: U$4.4(OUT4) U$24.3(GREEN) U$56.3(GREEN) U$88.3(GREEN) U$120.3(GREEN) U$152.3(GREEN) U$184.3(GREEN) U$216.3(GREEN) U$248.3(GREEN) U$280.3(GREEN) U$312.3(GREEN) U$344.3(GREEN) U$376.3(GREEN) U$408.3(GREEN) U$440.3(GREEN) U$472.3(GREEN) U$504.3(GREEN)
N$87: U$4.5(OUT5) U$24.4(BLUE) U$56.4(BLUE) U$88.4(BLUE) U$120.4(BLUE) U$152.4(BLUE) U$184.4(BLUE) U$216.4(BLUE) U$248.4(BLUE) U$280.4(BLUE) U$312.4(BLUE) U$344.4(BLUE) U$376.4(BLUE) U$408.4(BLUE) U$440.4(BLUE) U$472.4(BLUE) U$504.4(BLUE)
N$88: U$4.6(OUT6) U$25.1(RED) U$57.1(RED) U$89.1(RED) U$121.1(RED) U$153.1(RED) U$185.1(RED) U$217.1(RED) U$249.1(RED) U$281.1(RED) U$313.1(RED) U$345.1(RED) U$377.1(RED) U$409.1(RED) U$441.1(RED) U$473.1(RED) U$505.1(RED)
N$89: U$4.7(OUT7) U$25.3(GREEN) U$57.3(GREEN) U$89.3(GREEN) U$121.3(GREEN) U$153.3(GREEN) U$185.3(GREEN) U$217.3(GREEN) U$249.3(GREEN) U$281.3(GREEN) U$313.3(GREEN) U$345.3(GREEN) U$377.3(GREEN) U$409.3(GREEN) U$441.3(GREEN) U$473.3(GREEN) U$505.3(GREEN)
N$90: U$4.8(OUT8) U$25.4(BLUE) U$57.4(BLUE) U$89.4(BLUE) U$121.4(BLUE) U$153.4(BLUE) U$185.4(BLUE) U$217.4(BLUE) U$249.4(BLUE) U$281.4(BLUE) U$313.4(BLUE) U$345.4(BLUE) U$377.4(BLUE) U$409.4(BLUE) U$441.4(BLUE) U$473.4(BLUE) U$505.4(BLUE)
N$91: U$4.9(OUT9) U$26.1(RED) U$58.1(RED) U$90.1(RED) U$122.1(RED) U$154.1(RED) U$186.1(RED) U$218.1(RED) U$250.1(RED) U$282.1(RED) U$314.1(RED) U$346.1(RED) U$378.1(RED) U$410.1(RED) U$442.1(RED) U$474.1(RED) U$506.1(RED)
N$92: U$4.10(OUT10) U$26.3(GREEN) U$58.3(GREEN) U$90.3(GREEN) U$122.3(GREEN) U$154.3(GREEN) U$186.3(GREEN) U$218.3(GREEN) U$250.3(GREEN) U$282.3(GREEN) U$314.3(GREEN) U$346.3(GREEN) U$378.3(GREEN) U$410.3(GREEN) U$442.3(GREEN) U$474.3(GREEN) U$506.3(GREEN)
N$93: U$4.11(OUT11) U$26.4(BLUE) U$58.4(BLUE) U$90.4(BLUE) U$122.4(BLUE) U$154.4(BLUE) U$186.4(BLUE) U$218.4(BLUE) U$250.4(BLUE) U$282.4(BLUE) U$314.4(BLUE) U$346.4(BLUE) U$378.4(BLUE) U$410.4(BLUE) U$442.4(BLUE) U$474.4(BLUE) U$506.4(BLUE)
N$94: U$4.12(OUT12) U$27.1(RED) U$59.1(RED) U$91.1(RED) U$123.1(RED) U$155.1(RED) U$187.1(RED) U$219.1(RED) U$251.1(RED) U$283.1(RED) U$315.1(RED) U$347.1(RED) U$379.1(RED) U$411.1(RED) U$443.1(RED) U$475.1(RED) U$507.1(RED)
N$95: U$4.13(OUT13) U$27.3(GREEN) U$59.3(GREEN) U$91.3(GREEN) U$123.3(GREEN) U$155.3(GREEN) U$187.3(GREEN) U$219.3(GREEN) U$251.3(GREEN) U$283.3(GREEN) U$315.3(GREEN) U$347.3(GREEN) U$379.3(GREEN) U$411.3(GREEN) U$443.3(GREEN) U$475.3(GREEN) U$507.3(GREEN)
N$96: U$4.14(OUT14) U$27.4(BLUE) U$59.4(BLUE) U$91.4(BLUE) U$123.4(BLUE) U$155.4(BLUE) U$187.4(BLUE) U$219.4(BLUE) U$251.4(BLUE) U$283.4(BLUE) U$315.4(BLUE) U$347.4(BLUE) U$379.4(BLUE) U$411.4(BLUE) U$443.4(BLUE) U$475.4(BLUE) U$507.4(BLUE)
N$97: U$4.15(OUT15) U$28.1(RED) U$60.1(RED) U$92.1(RED) U$124.1(RED) U$156.1(RED) U$188.1(RED) U$220.1(RED) U$252.1(RED) U$284.1(RED) U$316.1(RED) U$348.1(RED) U$380.1(RED) U$412.1(RED) U$444.1(RED) U$476.1(RED) U$508.1(RED)
N$98: U$5.28(OUT0) U$28.3(GREEN) U$60.3(GREEN) U$92.3(GREEN) U$124.3(GREEN) U$156.3(GREEN) U$188.3(GREEN) U$220.3(GREEN) U$252.3(GREEN) U$284.3(GREEN) U$316.3(GREEN) U$348.3(GREEN) U$380.3(GREEN) U$412.3(GREEN) U$444.3(GREEN) U$476.3(GREEN) U$508.3(GREEN)
N$99: U$5.1(OUT1) U$28.4(BLUE) U$60.4(BLUE) U$92.4(BLUE) U$124.4(BLUE) U$156.4(BLUE) U$188.4(BLUE) U$220.4(BLUE) U$252.4(BLUE) U$284.4(BLUE) U$316.4(BLUE) U$348.4(BLUE) U$380.4(BLUE) U$412.4(BLUE) U$444.4(BLUE) U$476.4(BLUE) U$508.4(BLUE)
N$100: U$5.2(OUT2) U$29.1(RED) U$61.1(RED) U$93.1(RED) U$125.1(RED) U$157.1(RED) U$189.1(RED) U$221.1(RED) U$253.1(RED) U$285.1(RED) U$317.1(RED) U$349.1(RED) U$381.1(RED) U$413.1(RED) U$445.1(RED) U$477.1(RED) U$509.1(RED)
N$101: U$5.3(OUT3) U$29.3(GREEN) U$61.3(GREEN) U$93.3(GREEN) U$125.3(GREEN) U$157.3(GREEN) U$189.3(GREEN) U$221.3(GREEN) U$253.3(GREEN) U$285.3(GREEN) U$317.3(GREEN) U$349.3(GREEN) U$381.3(GREEN) U$413.3(GREEN) U$445.3(GREEN) U$477.3(GREEN) U$509.3(GREEN)
N$102: U$5.4(OUT4) U$29.4(BLUE) U$61.4(BLUE) U$93.4(BLUE) U$125.4(BLUE) U$157.4(BLUE) U$189.4(BLUE) U$221.4(BLUE) U$253.4(BLUE) U$285.4(BLUE) U$317.4(BLUE) U$349.4(BLUE) U$381.4(BLUE) U$413.4(BLUE) U$445.4(BLUE) U$477.4(BLUE) U$509.4(BLUE)
N$103: U$5.5(OUT5) U$30.1(RED) U$62.1(RED) U$94.1(RED) U$126.1(RED) U$158.1(RED) U$190.1(RED) U$222.1(RED) U$254.1(RED) U$286.1(RED) U$318.1(RED) U$350.1(RED) U$382.1(RED) U$414.1(RED) U$446.1(RED) U$478.1(RED) U$510.1(RED)
N$104: U$5.6(OUT6) U$30.3(GREEN) U$62.3(GREEN) U$94.3(GREEN) U$126.3(GREEN) U$158.3(GREEN) U$190.3(GREEN) U$222.3(GREEN) U$254.3(GREEN) U$286.3(GREEN) U$318.3(GREEN) U$350.3(GREEN) U$382.3(GREEN) U$414.3(GREEN) U$446.3(GREEN) U$478.3(GREEN) U$510.3(GREEN)
N$105: U$5.7(OUT7) U$30.4(BLUE) U$62.4(BLUE) U$94.4(BLUE) U$126.4(BLUE) U$158.4(BLUE) U$190.4(BLUE) U$222.4(BLUE) U$254.4(BLUE) U$286.4(BLUE) U$318.4(BLUE) U$350.4(BLUE) U$382.4(BLUE) U$414.4(BLUE) U$446.4(BLUE) U$478.4(BLUE) U$510.4(BLUE)
N$106: U$5.8(OUT8) U$31.1(RED) U$63.1(RED) U$95.1(RED) U$127.1(RED) U$159.1(RED) U$191.1(RED) U$223.1(RED) U$255.1(RED) U$287.1(RED) U$319.1(RED) U$351.1(RED) U$383.1(RED) U$415.1(RED) U$447.1(RED) U$479.1(RED) U$511.1(RED)
N$107: U$5.9(OUT9) U$31.3(GREEN) U$63.3(GREEN) U$95.3(GREEN) U$127.3(GREEN) U$159.3(GREEN) U$191.3(GREEN) U$223.3(GREEN) U$255.3(GREEN) U$287.3(GREEN) U$319.3(GREEN) U$351.3(GREEN) U$383.3(GREEN) U$415.3(GREEN) U$447.3(GREEN) U$479.3(GREEN) U$511.3(GREEN)
N$108: U$5.10(OUT10) U$31.4(BLUE) U$63.4(BLUE) U$95.4(BLUE) U$127.4(BLUE) U$159.4(BLUE) U$191.4(BLUE) U$223.4(BLUE) U$255.4(BLUE) U$287.4(BLUE) U$319.4(BLUE) U$351.4(BLUE) U$383.4(BLUE) U$415.4(BLUE) U$447.4(BLUE) U$479.4(BLUE) U$511.4(BLUE)
N$109: U$5.11(OUT11) U$32.1(RED) U$64.1(RED) U$96.1(RED) U$128.1(RED) U$160.1(RED) U$192.1(RED) U$224.1(RED) U$256.1(RED) U$288.1(RED) U$320.1(RED) U$352.1(RED) U$384.1(RED) U$416.1(RED) U$448.1(RED) U$480.1(RED) U$512.1(RED)
N$110: U$5.12(OUT12) U$32.3(GREEN) U$64.3(GREEN) U$96.3(GREEN) U$128.3(GREEN) U$160.3(GREEN) U$192.3(GREEN) U$224.3(GREEN) U$256.3(GREEN) U$288.3(GREEN) U$320.3(GREEN) U$352.3(GREEN) U$384.3(GREEN) U$416.3(GREEN) U$448.3(GREEN) U$480.3(GREEN) U$512.3(GREEN)
N$111: U$5.13(OUT13) U$32.4(BLUE) U$64.4(BLUE) U$96.4(BLUE) U$128.4(BLUE) U$160.4(BLUE) U$192.4(BLUE) U$224.4(BLUE) U$256.4(BLUE) U$288.4(BLUE) U$320.4(BLUE) U$352.4(BLUE) U$384.4(BLUE) U$416.4(BLUE) U$448.4(BLUE) U$480.4(BLUE) U$512.4(BLUE)
N$112: U$5.14(OUT14) U$33.1(RED) U$65.1(RED) U$97.1(RED) U$129.1(RED) U$161.1(RED) U$193.1(RED) U$225.1(RED) U$257.1(RED) U$289.1(RED) U$321.1(RED) U$353.1(RED) U$385.1(RED) U$417.1(RED) U$449.1(RED) U$481.1(RED) U$513.1(RED)
N$113: U$5.15(OUT15) U$33.3(GREEN) U$65.3(GREEN) U$97.3(GREEN) U$129.3(GREEN) U$161.3(GREEN) U$193.3(GREEN) U$225.3(GREEN) U$257.3(GREEN) U$289.3(GREEN) U$321.3(GREEN) U$353.3(GREEN) U$385.3(GREEN) U$417.3(GREEN) U$449.3(GREEN) U$481.3(GREEN) U$513.3(GREEN)
N$114: U$6.28(OUT0) U$33.4(BLUE) U$65.4(BLUE) U$97.4(BLUE) U$129.4(BLUE) U$161.4(BLUE) U$193.4(BLUE) U$225.4(BLUE) U$257.4(BLUE) U$289.4(BLUE) U$321.4(BLUE) U$353.4(BLUE) U$385.4(BLUE) U$417.4(BLUE) U$449.4(BLUE) U$481.4(BLUE) U$513.4(BLUE)
N$115: U$6.1(OUT1) U$34.1(RED) U$66.1(RED) U$98.1(RED) U$130.1(RED) U$162.1(RED) U$194.1(RED) U$226.1(RED) U$258.1(RED) U$290.1(RED) U$322.1(RED) U$354.1(RED) U$386.1(RED) U$418.1(RED) U$450.1(RED) U$482.1(RED) U$514.1(RED)
N$116: U$6.2(OUT2) U$34.3(GREEN) U$66.3(GREEN) U$98.3(GREEN) U$130.3(GREEN) U$162.3(GREEN) U$194.3(GREEN) U$226.3(GREEN) U$258.3(GREEN) U$290.3(GREEN) U$322.3(GREEN) U$354.3(GREEN) U$386.3(GREEN) U$418.3(GREEN) U$450.3(GREEN) U$482.3(GREEN) U$514.3(GREEN)
N$117: U$6.3(OUT3) U$34.4(BLUE) U$66.4(BLUE) U$98.4(BLUE) U$130.4(BLUE) U$162.4(BLUE) U$194.4(BLUE) U$226.4(BLUE) U$258.4(BLUE) U$290.4(BLUE) U$322.4(BLUE) U$354.4(BLUE) U$386.4(BLUE) U$418.4(BLUE) U$450.4(BLUE) U$482.4(BLUE) U$514.4(BLUE)
N$118: U$6.4(OUT4) U$35.1(RED) U$67.1(RED) U$99.1(RED) U$131.1(RED) U$163.1(RED) U$195.1(RED) U$227.1(RED) U$259.1(RED) U$291.1(RED) U$323.1(RED) U$355.1(RED) U$387.1(RED) U$419.1(RED) U$451.1(RED) U$483.1(RED) U$515.1(RED)
N$119: U$6.5(OUT5) U$35.3(GREEN) U$67.3(GREEN) U$99.3(GREEN) U$131.3(GREEN) U$163.3(GREEN) U$195.3(GREEN) U$227.3(GREEN) U$259.3(GREEN) U$291.3(GREEN) U$323.3(GREEN) U$355.3(GREEN) U$387.3(GREEN) U$419.3(GREEN) U$451.3(GREEN) U$483.3(GREEN) U$515.3(GREEN)
N$120: U$6.6(OUT6) U$35.4(BLUE) U$67.4(BLUE) U$99.4(BLUE) U$131.4(BLUE) U$163.4(BLUE) U$195.4(BLUE) U$227.4(BLUE) U$259.4(BLUE) U$291.4(BLUE) U$323.4(BLUE) U$355.4(BLUE) U$387.4(BLUE) U$419.4(BLUE) U$451.4(BLUE) U$483.4(BLUE) U$515.4(BLUE)
N$121: U$6.7(OUT7) U$36.1(RED) U$68.1(RED) U$100.1(RED) U$132.1(RED) U$164.1(RED) U$196.1(RED) U$228.1(RED) U$260.1(RED) U$292.1(RED) U$324.1(RED) U$356.1(RED) U$388.1(RED) U$420.1(RED) U$452.1(RED) U$484.1(RED) U$516.1(RED)
N$122: U$6.8(OUT8) U$36.3(GREEN) U$68.3(GREEN) U$100.3(GREEN) U$132.3(GREEN) U$164.3(GREEN) U$196.3(GREEN) U$228.3(GREEN) U$260.3(GREEN) U$292.3(GREEN) U$324.3(GREEN) U$356.3(GREEN) U$388.3(GREEN) U$420.3(GREEN) U$452.3(GREEN) U$484.3(GREEN) U$516.3(GREEN)
N$123: U$6.9(OUT9) U$36.4(BLUE) U$68.4(BLUE) U$100.4(BLUE) U$132.4(BLUE) U$164.4(BLUE) U$196.4(BLUE) U$228.4(BLUE) U$260.4(BLUE) U$292.4(BLUE) U$324.4(BLUE) U$356.4(BLUE) U$388.4(BLUE) U$420.4(BLUE) U$452.4(BLUE) U$484.4(BLUE) U$516.4(BLUE)
N$124: U$6.10(OUT10) U$37.1(RED) U$69.1(RED) U$101.1(RED) U$133.1(RED) U$165.1(RED) U$197.1(RED) U$229.1(RED) U$261.1(RED) U$293.1(RED) U$325.1(RED) U$357.1(RED) U$389.1(RED) U$421.1(RED) U$453.1(RED) U$485.1(RED) U$517.1(RED)
N$125: U$6.11(OUT11) U$37.3(GREEN) U$69.3(GREEN) U$101.3(GREEN) U$133.3(GREEN) U$165.3(GREEN) U$197.3(GREEN) U$229.3(GREEN) U$261.3(GREEN) U$293.3(GREEN) U$325.3(GREEN) U$357.3(GREEN) U$389.3(GREEN) U$421.3(GREEN) U$453.3(GREEN) U$485.3(GREEN) U$517.3(GREEN)
N$126: U$6.12(OUT12) U$37.4(BLUE) U$69.4(BLUE) U$101.4(BLUE) U$133.4(BLUE) U$165.4(BLUE) U$197.4(BLUE) U$229.4(BLUE) U$261.4(BLUE) U$293.4(BLUE) U$325.4(BLUE) U$357.4(BLUE) U$389.4(BLUE) U$421.4(BLUE) U$453.4(BLUE) U$485.4(BLUE) U$517.4(BLUE)
N$127: U$6.13(OUT13) U$38.1(RED) U$70.1(RED) U$102.1(RED) U$134.1(RED) U$166.1(RED) U$198.1(RED) U$230.1(RED) U$262.1(RED) U$294.1(RED) U$326.1(RED) U$358.1(RED) U$390.1(RED) U$422.1(RED) U$454.1(RED) U$486.1(RED) U$518.1(RED)
N$128: U$6.14(OUT14) U$38.3(GREEN) U$70.3(GREEN) U$102.3(GREEN) U$134.3(GREEN) U$166.3(GREEN) U$198.3(GREEN) U$230.3(GREEN) U$262.3(GREEN) U$294.3(GREEN) U$326.3(GREEN) U$358.3(GREEN) U$390.3(GREEN) U$422.3(GREEN) U$454.3(GREEN) U$486.3(GREEN) U$518.3(GREEN)
N$129: U$6.15(OUT15) U$38.4(BLUE) U$70.4(BLUE) U$102.4(BLUE) U$134.4(BLUE) U$166.4(BLUE) U$198.4(BLUE) U$230.4(BLUE) U$262.4(BLUE) U$294.4(BLUE) U$326.4(BLUE) U$358.4(BLUE) U$390.4(BLUE) U$422.4(BLUE) U$454.4(BLUE) U$486.4(BLUE) U$518.4(BLUE)
N$130: R6.1 U$1.20(IREF)
N$131: R1.1 U$2.20(IREF)
N$132: R2.1 U$3.20(IREF)
N$133: R3.1 U$4.20(IREF)
N$134: R4.1 U$5.20(IREF)
N$135: R5.1 U$6.20(IREF)
N$136: C17.+ D1.C IC3.3(VI)
N$138: D1.A U$519.TIP
OUTEN: IC1.15(OE) IC2.15(OE) SHIFTPINS.3
SCLK: TLCPINS.1 U$1.25(SCLK) U$2.25(SCLK) U$3.25(SCLK) U$4.25(SCLK) U$5.25(SCLK) U$6.25(SCLK)
SHCLK: IC1.3(CLK) IC2.3(CLK) SHIFTPINS.5
SHDATA: IC1.2(D) SHIFTPINS.4
SIN: TLCPINS.2 U$1.26(SIN)
SOUTA: U$1.17(SOUT) U$2.26(SIN)
SOUTB: U$2.17(SOUT) U$3.26(SIN)
SOUTC: U$3.17(SOUT) U$4.26(SIN)
SOUTD: U$4.17(SOUT) U$5.26(SIN)
SOUTE: U$5.17(SOUT) U$6.26(SIN)
STROBE: IC1.1(STR) IC2.1(STR) SHIFTPINS.6
VPRG: TLCPINS.5 U$1.27(VPRG) U$2.27(VPRG) U$3.27(VPRG) U$4.27(VPRG) U$5.27(VPRG) U$6.27(VPRG)
XLAT: TLCPINS.3 U$1.24(XLAT) U$2.24(XLAT) U$3.24(XLAT) U$4.24(XLAT) U$5.24(XLAT) U$6.24(XLAT)
Unconnected: IC1.10(QS*) IC2.9(QS) IC2.10(QS*) U$1.16(XERR) U$1.19(DCPRG) U$2.16(XERR) U$2.19(DCPRG) U$3.16(XERR) U$3.19(DCPRG) U$4.16(XERR) U$4.19(DCPRG) U$5.16(XERR) U$5.19(DCPRG) U$6.16(XERR) U$6.17(SOUT) U$6.19(DCPRG)

## Library data of the parts
C1-C16 = adafruit:C-US: CAPACITOR, American symbol
C17 C18 = rcl:CPOL-US: POLARIZED CAPACITOR, American symbol
D1 = diode:1N4148: DIODE high speed (Philips)
IC1 IC2 = 40xx:4094: 8-stage SHIFT/STORE REGISTER, tri-state
IC3 = linear:MC33269?*: Adjustable Output Low Dropout Voltage Regulator 800 mA Source: http://www.onsemi.com/pub/Collateral/MC33269-D.PDF
Q17-Q32 = adafruit:PFET: P-CHANNEL MOS FET
R1-R22 = resistor:R-US_: RESISTOR, American symbol
SHIFTPINS TLCPINS = pinhead:PINHD-1X6: PIN HEADER
U$1-U$6 = tlc5940:TLC5940
U$7-U$518 = rgbled:RGBLEDAN
U$519 = adafruit:2.1MMJACK: 2.1mm x 5.5mm THM DC jack with internal switch. Digikey part #PJ-102A, 4UCON part #05537 2.1mm x 5.5mm SMT DC jack with internal switch. Digikey part #PJ-002A-SMT, 4UCON part #03267 By microbuilder.eu & adafruit.com

## Net classes
0 default: width 0.406 mm, drill 0.305 mm, clearance 0.305 mm